# Altium project B106AA.PrjPcb (part 4 of 5)

## Sheet Battery Feed and Socket.SchDoc: System Battery Feed and Battery Socket
size A4; ApprovedBy: Mehmet Günce Akkoyun; CheckedBy: Mehmet Günce Akkoyun; Author: Mehmet Günce Akkoyun; CompanyName: Ovoo Electronics; DrawnBy: Mehmet Günce Akkoyun; Engineer: Mehmet Günce Akkoyun; Organization: Ovoo Electronics; Address1: Küçük Ýhsaniye Mah.; Address2: Mýzraklý Sok. No:15; Address3: Meram / Konya; Address4: Turkiye; DocumentNumber: AA005; Revision: B106AA; SheetNumber: 3; SheetTotal: 37
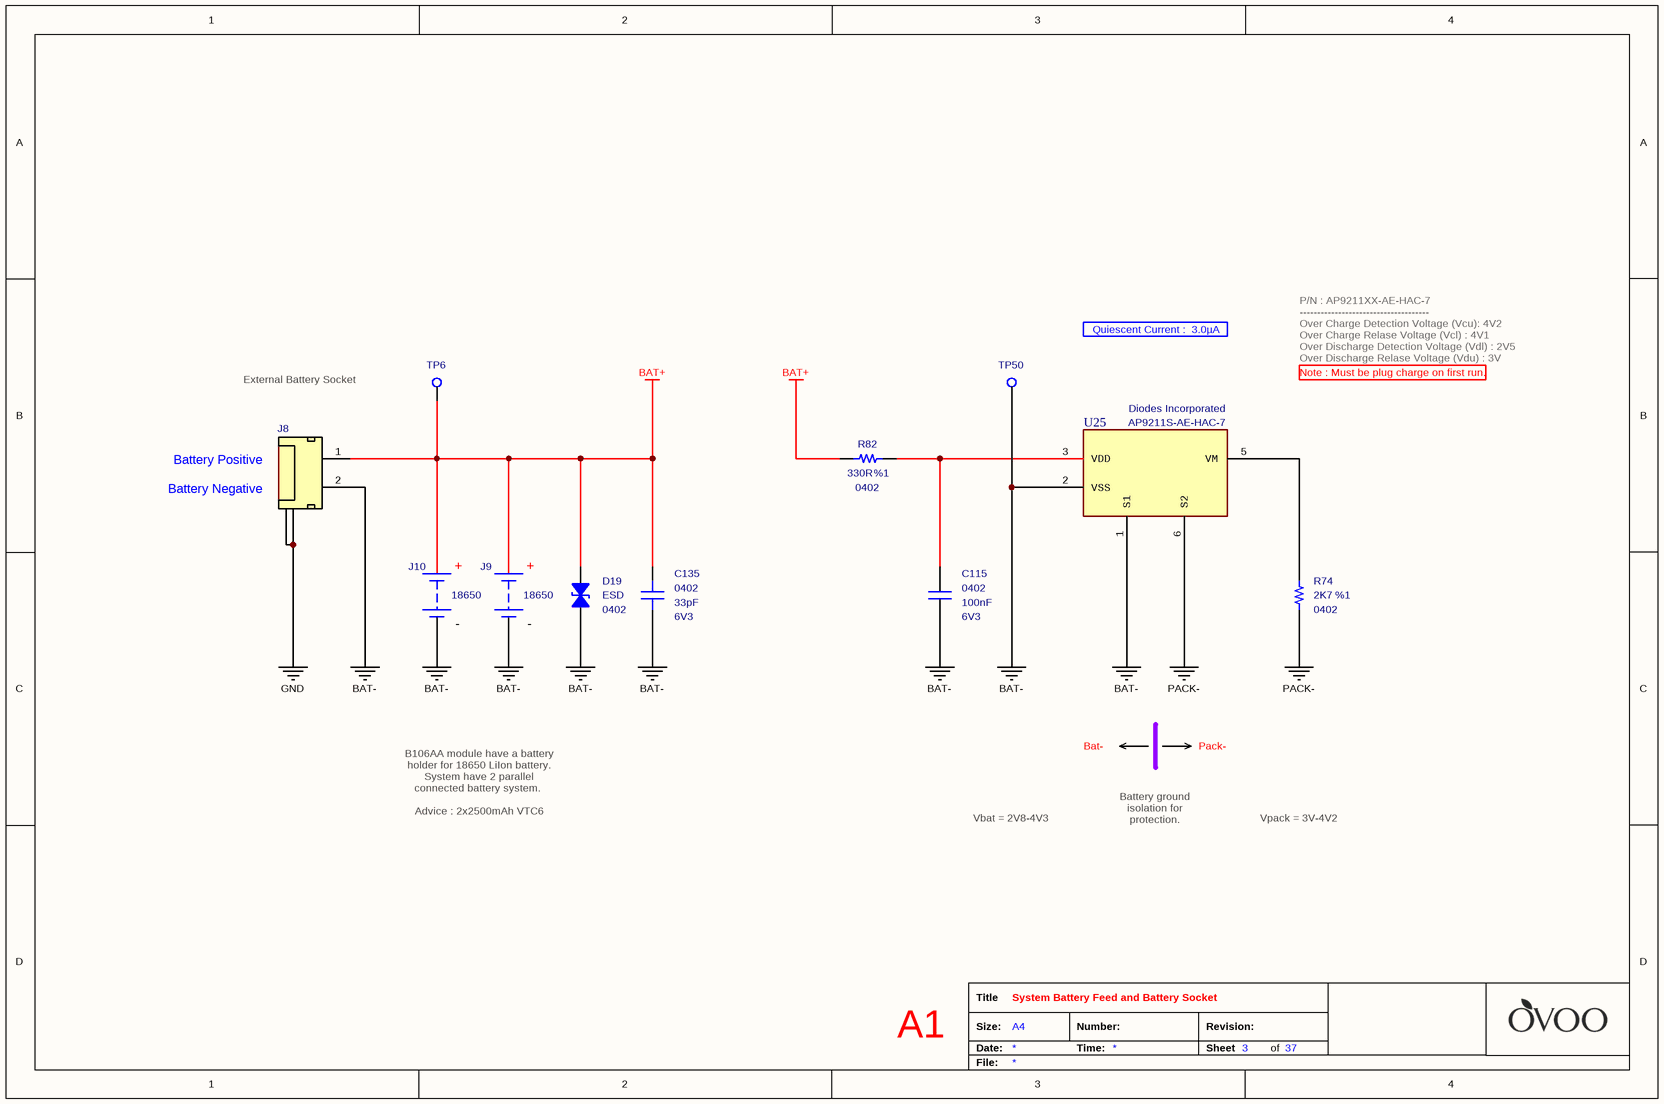
[diagram p29: Battery Feed and Socket.SchDoc]

### Parts
C115  value 100nF  Case: 0402  Voltage: 6V3  [CAPACITOR_0402]  (hidden comment: Multilayer Ceramic Capacitor)
C135  value 33pF  Case: 0402  Voltage: 6V3  [CAPACITOR_0402]  (hidden comment: Multilayer Ceramic Capacitor)
D19  Case: 0402  [ESD_0402]  (hidden comment: ESD Suppressors)
J8  External Battery Socket  [Connector_Tunic 2P - H]  (value not drawn)
J9  Battery Size: 18650  [BATTERY_HOLDER - Bat - NoSilk]  (hidden comment: Battery Clip Holder and Battery)
J10  Battery Size: 18650  [BATTERY_HOLDER - Bat - NoSilk]  (hidden comment: Battery Clip Holder and Battery)
R74  value 2K7  Case: 0402  Tolerance: %1  [RESISTOR_0402]  (hidden comment: Thick Film Resistor)
R82  value 330R  Tolerance: %1  Case: 0402  [RESISTOR_0402]  (hidden comment: Thick Film Resistor)
TP6  PCB - Test Point  [Test_Pad - Hole]  (value not drawn)  (no BOM)
TP50  PCB - Test Point  [Test_Pad - Hole]  (value not drawn)  (no BOM)
U25  Manufacturer_Part_Number: AP9211S-AE-HAC-7  Manufacturer_Name: Diodes Incorporated  [AP9211]  (hidden comment: Battery Management IC)

### Nets
BAT+: C135.2 D19.2 J8.1(BAT+) J9.1(BAT+) J10.1(BAT+) R82.2 TP6.1
BAT-: C115.2 C135.1 D19.1 J8.2(BAT-) J9.2(BAT-) J10.2(BAT-) TP50.1 U25.1(S1) U25.2(VSS)
GND: J8.3(Termination) J8.4(Termination)
PACK-: R74.1 U25.6(S2)
NetC115_1: C115.1 R82.1 U25.3(VDD)
NetR74_2: R74.2 U25.5(VM)

### Notes on the sheet
- Quiescent Current :  3.0µA
- External Battery Socket
- P/N : AP9211XX-AE-HAC-7
  -------------------------------------
  Over Charge Detection Voltage (Vcu): 4V2
  Over Charge Relase Voltage (Vcl) : 4V1
  Over Discharge Detection Voltage (Vdl) : 2V5
  Over Discharge Relase Voltage (Vdu) : 3V
- Note : Must be plug charge on first run.
- (near J8) Battery Positive
  Battery Negative
- Bat-
- Pack-
- B106AA module have a battery holder for 18650 LiIon battery. System have 2 parallel connected battery system.
  Advice : 2x2500mAh VTC6
- Vbat = 2V8-4V3
- Battery ground isolation for protection.
- Vpack = 3V-4V2
- A1
- Title
- Size:
- Date:
- A4
- Number:
- Time:
- Revision:
- Sheet
- of
- File:
- (in symbol Connector - Battery Clip Holder + Battery) +; -
- (in symbol Diode - ESD Protection) ESD

### Library data of the parts
C115 = Capacitor - 100nF [0402-6V3]: as C32 on sheet Bidirectional Voltage Translator; Height: 0.25mm; Mouser_Part_Number: 581-04026D104KAT4A; ComponentLink1Description: Mouser; ComponentLink1URL: https://www.mouser.com.tr/ProductDetail/AVX/04026D104KAT4A?qs=sGAEpiMZZMs0AnBnWHyRQPg4iYkCw7IMED%2F4kpqgf7w%3D; ComponentLink2Description: DataSheet; ComponentLink2URL: https://www.mouser.com.tr/datasheet/2/40/cx5r-776519.pdf; ROHS: Yes; Maximum Operating Temperature: +85; Minimum Operating Temperature: -55; Supplier 1: Avnet; Supplier Part Number 1: 04026D104KAT4A
C135 = Capacitor - 33pF [0402-6V3]: as C46 on sheet GE910QUAD Modem; Height: 0.5mm; Mouser_Part_Number: 80-C0402C330J9RAUTO; Maximum Operating Temperature: +125; Minimum Operating Temperature: -55; ROHS: Yes; ComponentLink1Description: DataSheet; ComponentLink1URL: https://api.kemet.com/component-edge/download/datasheet/C0402C330J9RACAUTO.pdf; ComponentLink2Description: Mouser; ComponentLink2URL: https://www.mouser.com/Search/Refine.aspx?Keyword=80-C0402C330J9RAUTO; Supplier 1: Mouser; Supplier Part Number 1: 80-C0402C330J9RAUTO
D19 = Diode - ESD Protection: TVS Diode (Bi-directional); Manufacturer_Part_Number: 0402ESDA-MLP1; Manufacturer_Name: Bussmann / Eaton; Clamping Voltage: 35V; Diode Capacitance: 0.05pF; Polarity: Bidirectional; Voltage ESD Air Gap: 15kV; Voltage ESD Contact: 8kV; Working Voltage: 30V; Height: 0.436mm; Mouser_Part_Number: 504-0402ESDA-MLP1; Maximum Operating Temperature: +125; Minimum Operating Temperature: -55; ROHS: Yes; ComponentLink1Description: DataSheet; ComponentLink1URL: https://www.mouser.com.tr/datasheet/2/87/47c59e11-d058-4882-bc35-d8572f2ca054-38826.pdf; ComponentLink2Description: Mouser; ComponentLink2URL: https://www.mouser.com.tr/ProductDetail/Bussmann-Eaton/0402ESDA-MLP1?qs=%2Fha2pyFadughxyc7TyLWeW%2FUvipVY6Ex3naV%2FjpO3plZBZWDLqV4bw%3D%3D; Supplier 1: Mouser; Supplier 2: Digi-Key; Supplier Part Number 2: 283-2964-1-ND; Supplier Part Number 1: 504-0402ESDA-MLP1
J8 = Connector - Mini Tunic 2P (1.25): Mini Tunic Connector with 2P; Manufacturer_Name: Molex; Manufacturer_Part_Number: 53261-0271; Height: 3.55mm; Mouser_Part_Number: 538-53261-0271; ROHS: Yes; Supplier 1: Mouser; Supplier 2: Digi-Key; Supplier Part Number 1: 538-53261-0271; Supplier Part Number 2: WM7620DKR-ND
J9 J10 = Connector - Battery Clip Holder + Battery: Cylindrical Battery Contacts, Clips, Holders & Springs 16MM - 19MM SM BATTERY CLIP; Manufacturer_Name: Keystone Electronics; Manufacturer_Part_Number: 254; ROHS: Yes; ComponentLink1Description: DataSheet; ComponentLink1URL: https://www.mouser.com.tr/datasheet/2/215/254-1662482.pdf; ComponentLink2Description: Mouser; ComponentLink2URL: https://www.mouser.com.tr/ProductDetail/Keystone-Electronics/254?qs=sGAEpiMZZMt13fpse6CWDeN7rxuhSMCmCb8dqu6gK9OS7H31eWULIQ==; Mouser_Part_Number: 534-254; Supplier 1: Mouser; Supplier Part Number 1: 534-550
R74 = Resistor - 2K7: Thick Film Resistors - SMD 1/16 W 2.7 Kohms 1%; Manufacturer_Name: Vishay; Manufacturer_Part_Number: CRCW04022K70FKED; Height: 0.35mm; Mouser_Part_Number: 71-CRCW0402-2.7K-E3; ComponentLink1Description: DataSheet; ComponentLink1URL: https://www.mouser.com.tr/datasheet/2/427/dcrcwe3-1762152.pdf; ComponentLink2Description: Mouser; ComponentLink2URL: https://www.mouser.com.tr/ProductDetail/Vishay-Dale/CRCW04022K70FKED?qs=sGAEpiMZZMu61qfTUdNhG7nHf%2F6MTUn3G4wz%252BGDNrew%3D; Supplier 1: Digi-Key; Supplier Part Number 1: 541-2.70KLCT-ND
R82 = Resistor - 330R: Thick Film Resistors - SMD 1/16 W 330 Ohm 1%; Manufacturer_Name: Vishay; Manufacturer_Part_Number: CRCW0402330RFKED; Height: 0.4mm; Mouser_Part_Number: 71-CRCW0402-330-E3; ComponentLink1Description: DataSheet; ComponentLink1URL: https://www.mouser.com.tr/datasheet/2/427/dcrcwe3-1762152.pdf; ComponentLink2Description: Mouser; ComponentLink2URL: https://www.mouser.com.tr/ProductDetail/Vishay-Dale/CRCW0402330RFKED?qs=sGAEpiMZZMu61qfTUdNhG2DpbjADlD3GGS6SwBlLi5Q%3D; Supplier 1: Mouser; Supplier 2: Digi-Key; Supplier Part Number 2: 541-330LCT-ND; Supplier Part Number 1: 71-CRCW0402-330-E3
TP6 TP50 = PCB - Test Point: Test Point
U25 = IC - AP9211: Battery Management SGL Chip Protection 12Vdss 12Vgss 1000mW; AECQ10x: No; Built-In Dual NMOS: Yes; Charge Overcurrent Detection Voltage VCOC: 0.2 to 0.05 V; Detection Delay: Built-In Delay Timer; Discharge Overcurrent Detection Voltage VDOC: 0.05 to 0.32 V; Function: Battery Protection; Load Short Detection Voltage VSHORT: 0.16 to 0.32 V; Overcharge Detection Voltage VCU: 3.5 to 4.5 V; Overdischarge Detection Voltage VDL: 2 to 3.4 V; Power-Down Function: Selectable; RSS(ON) @VGS=3.9V: 27 mΩ; RoHS: Yes; Mouser_Part_Number: 621-AP9211S-AE-HAC-7; Case: U-DFN2030-6; ComponentLink1Description: DataSheet; ComponentLink1URL: https://www.mouser.com.tr/datasheet/2/115/AP9211-838143.pdf; ComponentLink2Description: Mouser; ComponentLink2URL: https://www.mouser.com.tr/ProductDetail/Diodes-Incorporated/AP9211S-AE-HAC-7?qs=%2Fha2pyFaduhU8ORG8s%252BdQ0PvBZ%252Bj6P04h11i28rtWnQ%2FLO517Oqhtw%3D%3D; ComponentLink3Description: ProductPage; ComponentLink3URL: https://www.diodes.com/part/view/AP9211; Application: 1-Cell; Automotive Compliant PPAP: No; Supplier 1: Mouser; Supplier Part Number 1: 621-AP9211S-AE-HAC-7

## Sheet Battery Measurement.SchDoc: Battery Measurement With I2C Isolation
size A4; ApprovedBy: Mehmet Günce Akkoyun; CheckedBy: Mehmet Günce Akkoyun; Author: Mehmet Günce Akkoyun; CompanyName: Ovoo Electronics; DrawnBy: Mehmet Günce Akkoyun; Engineer: Mehmet Günce Akkoyun; Organization: Ovoo Electronics; Address1: Küçük Ýhsaniye Mah.; Address2: Mýzraklý Sok. No:15; Address3: Meram / Konya; Address4: Turkiye; DocumentNumber: AA005; Revision: B106AA; SheetNumber: 4; SheetTotal: 37
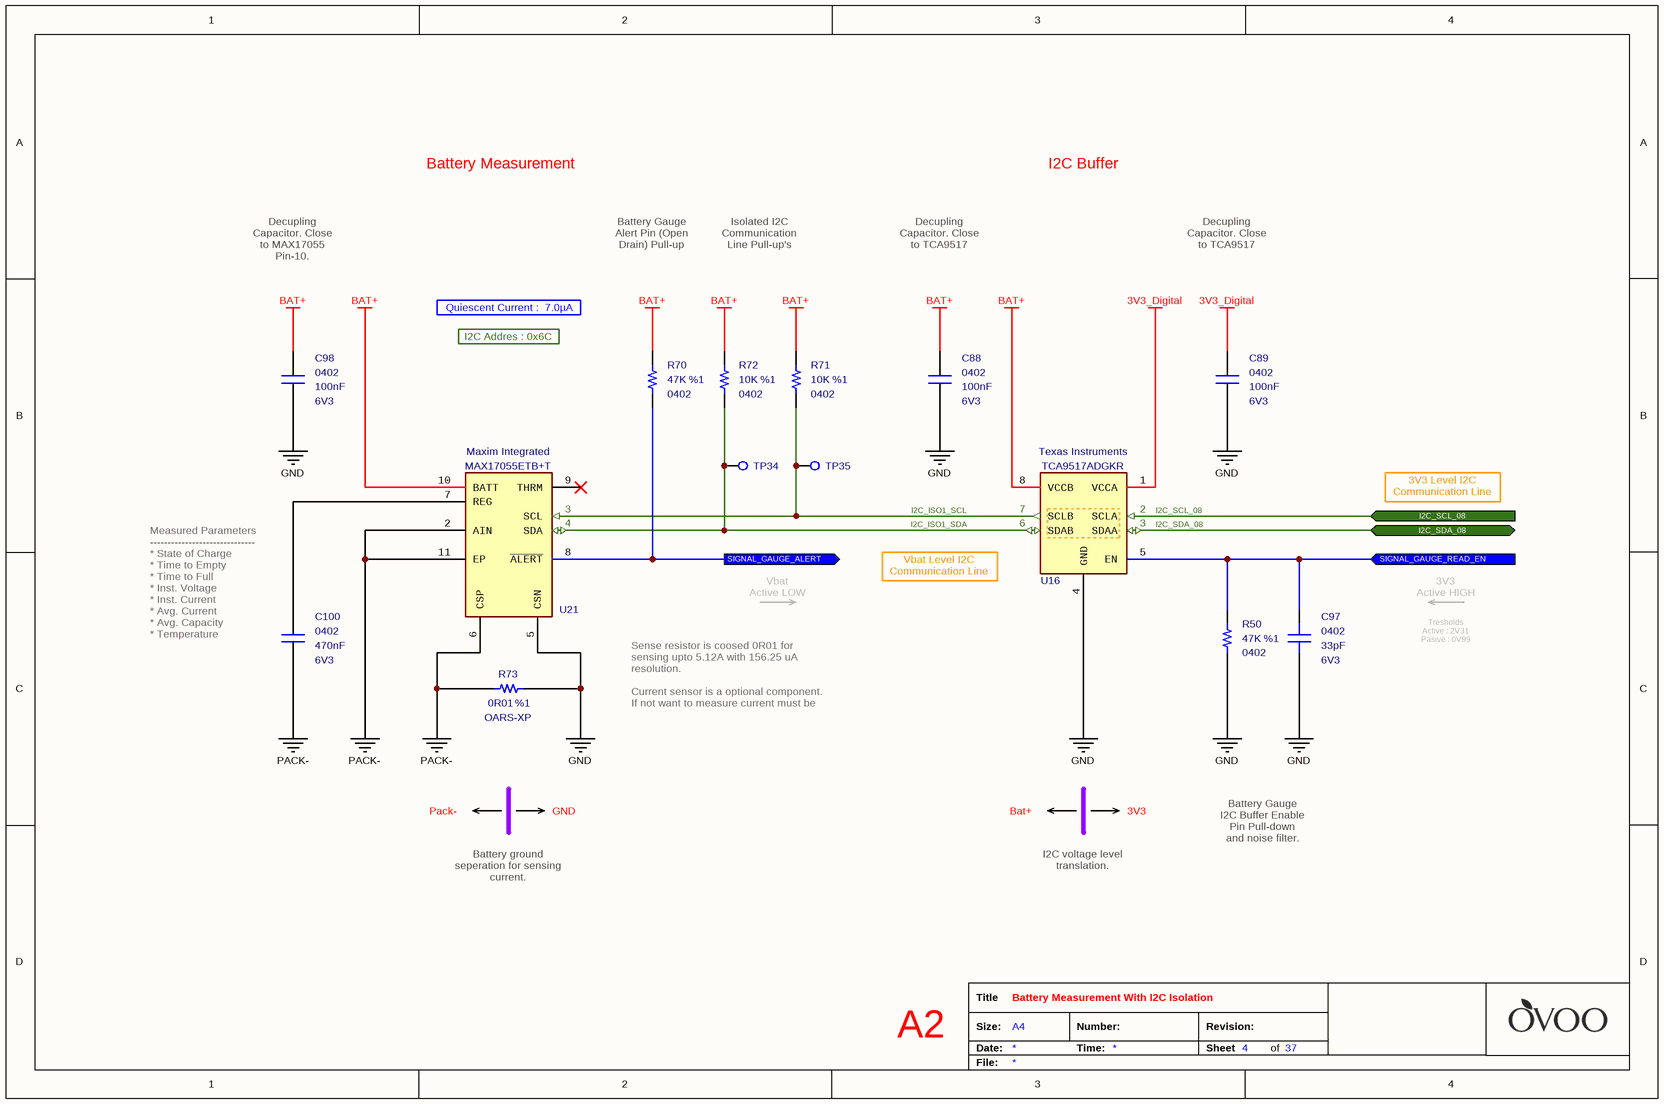
[diagram p30: Battery Measurement.SchDoc]

### Parts
C88  value 100nF  Case: 0402  Voltage: 6V3  [CAPACITOR_0402]  (hidden comment: Multilayer Ceramic Capacitor)
C89  value 100nF  Case: 0402  Voltage: 6V3  [CAPACITOR_0402]  (hidden comment: Multilayer Ceramic Capacitor)
C97  value 33pF  Case: 0402  Voltage: 6V3  [CAPACITOR_0402]  (hidden comment: Multilayer Ceramic Capacitor)
C98  value 100nF  Case: 0402  Voltage: 6V3  [CAPACITOR_0402]  (hidden comment: Multilayer Ceramic Capacitor)
C100  value 470nF  Case: 0402  Voltage: 6V3  [CAPACITOR_0402]  (hidden comment: Multilayer Ceramic Capacitors)
R50  value 47K  Tolerance: %1  Case: 0402  [RESISTOR_0402]  (hidden comment: Thick Film Resistor)
R70  value 47K  Tolerance: %1  Case: 0402  [RESISTOR_0402]  (hidden comment: Thick Film Resistor)
R71  value 10K  Tolerance: %1  Case: 0402  [RESISTOR_0402]  (hidden comment: Thick Film Resistor)
R72  value 10K  Tolerance: %1  Case: 0402  [RESISTOR_0402]  (hidden comment: Thick Film Resistor)
R73  value 0R01  Case: OARS-XP  Tolerance: %1  [RESISTOR_OARSXP]  (hidden comment: Current Sense Resistor)
TP34  PCB - Test Point  [Test_Pad - Hole]  (value not drawn)  (no BOM)
TP35  PCB - Test Point  [Test_Pad - Hole]  (value not drawn)  (no BOM)
U16  Manufacturer_Name: Texas Instruments  Manufacturer_Part_Number: TCA9517ADGKR  [MSOP-8-4]  (hidden comment: I2C Bus Repeater)
U21  Manufacturer_Part_Number: MAX17055ETB+T  Manufacturer_Name: Maxim Integrated  [TDFN-10]  (hidden comment: Battery Gauge)

### Ports
I2C_SCL_08 (in), I2C_SDA_08 (bidir), SIGNAL_GAUGE_ALERT (out), SIGNAL_GAUGE_READ_EN (in)

### Nets
3V3_Digital: C89.1 U16.1(VCCA)
BAT+: C88.1 C98.1 R70.2 R71.2 R72.2 U16.8(VCCB) U21.10(BATT)
GND: C88.2 C89.2 C97.1 C98.2 R50.1 R73.1 U16.4(GND) U21.5(CSN)
PACK-: C100.1 R73.2 U21.2(AIN) U21.6(CSP) U21.11(EP)
I2C_ISO1_SCL: R71.1 TP35.1(TP) U16.7(SCLB) U21.3(SCL)
I2C_ISO1_SDA: R72.1 TP34.1 U16.6(SDAB) U21.4(SDA)
I2C_SCL_08: U16.2(SCLA) ; port I2C_SCL_08
I2C_SDA_08: U16.3(SDAA) ; port I2C_SDA_08
SIGNAL_GAUGE_ALERT: R70.1 U21.8(~{ALERT}) ; port SIGNAL_GAUGE_ALERT
NetC97_2: C97.2 R50.2 U16.5(EN) ; port SIGNAL_GAUGE_READ_EN
NetC100_2: C100.2 U21.7(REG)

Not connected (* = marked no-connect by the designer): U21 9(THRM)*

### Notes on the sheet
- Battery Measurement
- I2C Buffer
- Decupling Capacitor. Close to MAX17055 Pin-10.
- Battery Gauge Alert Pin (Open Drain) Pull-up
- Isolated I2C Communication Line Pull-up's
- Decupling Capacitor. Close to TCA9517 Pin-8.
- Decupling Capacitor. Close to TCA9517 Pin-1.
- Quiescent Current :  7.0µA
- I2C Addres : 0x6C
- 3V3 Level I2C
  Communication Line
- Vbat
  Active LOW
- (near U16) Vbat Level I2C
  Communication Line
- 3V3
  Active HIGH
- (near C100) Measured Parameters
  ------------------------------
  * State of Charge
  * Time to Empty
  * Time to Full
  * Inst. Voltage
  * Inst. Current
  * Avg. Current
  * Avg. Capacity
  * Temperature
- Tresholds
  Active : 2V31
  Pasive : 0V99
- Sense resistor is coosed 0R01 for sensing upto 5.12A with 156.25 uA resolution.
  Current sensor is a optional component. If not want to measure current must be connect PACK- to GND.
- Pack-
- GND
- Bat+
- 3V3
- Battery Gauge I2C Buffer Enable Pin Pull-down and noise filter.
- Battery ground seperation for sensing current.
- I2C voltage level translation.
- A2
- Title
- Size:
- Date:
- A4
- Number:
- Time:
- Revision:
- Sheet
- of
- File:

### Library data of the parts
C88 C89 C98 = Capacitor - 100nF [0402-6V3]: Capacitor - 100nF [0402-6V3] (Ceramic); Manufacturer_Name: AVX; Manufacturer_Part_Number: 04026D104KAT4A; Dielectric: X5R; Tolerance: %10; Height: 0.25mm; Mouser_Part_Number: 581-04026D104KAT4A; ComponentLink1Description: Mouser; ComponentLink1URL: https://www.mouser.com.tr/ProductDetail/AVX/04026D104KAT4A?qs=sGAEpiMZZMs0AnBnWHyRQPg4iYkCw7IMED%2F4kpqgf7w%3D; ComponentLink2Description: DataSheet; ComponentLink2URL: https://www.mouser.com.tr/datasheet/2/40/cx5r-776519.pdf; ROHS: Yes; Maximum Operating Temperature: +85; Minimum Operating Temperature: -55; Supplier 1: Avnet; Supplier Part Number 1: 04026D104KAT4A
C97 = Capacitor - 33pF [0402-6V3]: Capacitor - 33pF [0402] (Ceramic); Manufacturer_Name: Kemet; Manufacturer_Part_Number: C0402C330J9RACAUTO; Dielectric: X7R; Tolerance: 10%; Height: 0.5mm; Mouser_Part_Number: 80-C0402C330J9RAUTO; Maximum Operating Temperature: +125; Minimum Operating Temperature: -55; ROHS: Yes; ComponentLink1Description: DataSheet; ComponentLink1URL: https://api.kemet.com/component-edge/download/datasheet/C0402C330J9RACAUTO.pdf; ComponentLink2Description: Mouser; ComponentLink2URL: https://www.mouser.com/Search/Refine.aspx?Keyword=80-C0402C330J9RAUTO; Supplier 1: Mouser; Supplier Part Number 1: 80-C0402C330J9RAUTO
C100 = Capacitor - 470nF [0402-6V3]: Capacitor - 470nF [0402] (Ceramic); Manufacturer_Name: AVX; Manufacturer_Part_Number: 04026C474KAT2A; Dielectric: X7R; Tolerance: %10; Height: 0.4mm; Mouser_Part_Number: 581-04026C474KAT2A; ComponentLink1Description: Mouser; ComponentLink1URL: https://www.mouser.com.tr/ProductDetail/AVX/04026D104KAT4A?qs=sGAEpiMZZMs0AnBnWHyRQPg4iYkCw7IMED%2F4kpqgf7w%3D; ComponentLink2Description: DataSheet; ComponentLink2URL: https://www.mouser.com.tr/datasheet/2/40/cx5r-776519.pdf; ROHS: Yes; Maximum Operating Temperature: +125; Minimum Operating Temperature: -55; Supplier 1: Mouser; Supplier Part Number 1: 581-04026C474KAT2A
R50 R70 = Resistor - 47K: Thick Film Resistors - SMD 1/16 W 47 Kohms 1%; Manufacturer_Name: Vishay; Manufacturer_Part_Number: CRCW040247K0FKED; Height: 0.4mm; Mouser_Part_Number: 71-CRCW0402-47K-E3; ComponentLink1Description: DataSheet; ComponentLink1URL: https://www.mouser.com.tr/datasheet/2/427/dcrcwe3-1762152.pdf; ComponentLink2Description: Mouser; ComponentLink2URL: https://www.mouser.com.tr/ProductDetail/Vishay-Dale/CRCW040247K0FKED?qs=sGAEpiMZZMu61qfTUdNhG2DpbjADlD3GL%252B3h1elTxqU%3D; Supplier 1: Mouser; Supplier 2: Digi-Key; Supplier Part Number 1: 71-CRCW040247K0FKEDH; Supplier Part Number 2: 541-47.0KYCT-ND
R71 R72 = Resistor - 10K: Thick Film Resistors - SMD 1/16 W 10 Kohms 1%; Manufacturer_Name: Vishay; Manufacturer_Part_Number: CRCW040210K0FKED; Height: 0.4mm; Mouser_Part_Number: 71-CRCW0402-10K-E3; ComponentLink1Description: DataSheet; ComponentLink1URL: https://www.mouser.com.tr/datasheet/2/427/dcrcwe3-1762152.pdf; ComponentLink2Description: Mouser; ComponentLink2URL: https://www.mouser.com.tr/ProductDetail/Vishay-Dale/CRCW040210K0FKED?qs=sGAEpiMZZMu61qfTUdNhG2DpbjADlD3GcalbOv9utCY%3D; Supplier 1: Mouser; Supplier 2: Digi-Key; Supplier Part Number 1: 71-CRCW040210K0FKEDH; Supplier Part Number 2: 541-10.0KYCT-ND
R73 = Resistor - 0R01 (Current Sense): Current Sense Resistors - SMD 10 W 0.01 ohms 1%; Manufacturer_Name: TT Electronics; Manufacturer_Part_Number: OARSXPR010FLF; Height: 4.57mm; Mouser_Part_Number: 66-OARSXPR010FLF; ComponentLink1Description: DataSheet; ComponentLink1URL: https://www.mouser.com.tr/datasheet/2/414/OARS-1528401.pdf; ComponentLink2Description: Mouser; ComponentLink2URL: https://www.mouser.com.tr/ProductDetail/Welwyn-Components-TT-Electronics/OARSXPR010FLF?qs=sGAEpiMZZMtlleCFQhR%2FzeTNl4NhfdapppP6XDTtD%252Bk%3D; Supplier 1: Mouser; Supplier 2: Arrow; Supplier Part Number 1: 66-OARSXPR010FLF; Supplier Part Number 2: OARSXPR010FLF
TP34 TP35 = PCB - Test Point: Test Point
U16 = IC - TCA9517ADGKR: Interface - Signal Buffers, Repeaters Level-Translting I2C Bus Repeater; Propagation Delay Time: 141 nS; Operating Supply Voltage: 900 mV to 5.5 V; Operating Supply Current: 1mA; Ciss - Input Capacitance: 8pF; Height: 1.1mm; Mouser Part Number: 595-TCA9517ADGKR; ComponentLink1Description: DataSheet; ComponentLink1URL: http://www.ti.com/general/docs/suppproductinfo.tsp?distId=26&gotoUrl=http%3A%2F%2Fwww.ti.com%2Flit%2Fgpn%2Ftca9517a; ComponentLink2Description: Mouser; ComponentLink2URL: https://www.mouser.com.tr/ProductDetail/Texas-Instruments/TCA9517ADGKR?qs=%252BrH4t%252BeVZ2M4pVnwXR4oNA==; Minimum Operating Temperature: -40; Maximum Operating Temperature: +85; Case: VSSOP-8; Supplier 1: Mouser; Supplier 2: Digi-Key; Supplier Part Number 1: 595-TCA9517ADGKR; Supplier Part Number 2: 296-39220-1-ND
U21 = IC - MAX17055ETB+T: Battery Management Stand-Alone ModelGauge m5 Fuel Gauge; Battery Type: Li-Ion, LiFePO4; Operating Supply Current: 18 uA; Operating Supply Voltage: 2.3 V to 4.9 V; Height: 0.8mm; Mouser_Part_Number: 700-MAX17055ETB+T; ComponentLink1Description: DataSheet; ComponentLink1URL: https://www.mouser.com.tr/datasheet/2/256/MAX17055-1097125.pdf; ComponentLink2Description: Mouser; ComponentLink2URL: https://www.mouser.com.tr/ProductDetail/Maxim-Integrated/MAX17055ETB%2bT?qs=sGAEpiMZZMve4%2FbfQkoj%252BAs6FTSsQJaJrD7Z3v0Qe9M%3D; Minimum Operating Temperature: -40; Maximum Operating Temperature: +85; Case: TDFN-10; Supplier 1: Mouser; Supplier 2: Digi-Key; Supplier Part Number 2: MAX17055ETB+TCT-ND; Supplier Part Number 1: 700-MAX17055ETB+T

## Sheet Battery Charger.SchDoc: Battery Charger
size A4; ApprovedBy: Mehmet Günce Akkoyun; CheckedBy: Mehmet Günce Akkoyun; Author: Mehmet Günce Akkoyun; CompanyName: Ovoo Electronics; DrawnBy: Mehmet Günce Akkoyun; Engineer: Mehmet Günce Akkoyun; Organization: Ovoo Electronics; Address1: Küçük Ýhsaniye Mah.; Address2: Mýzraklý Sok. No:15; Address3: Meram / Konya; Address4: Turkiye; DocumentNumber: AA005; Revision: B106AA; SheetNumber: 5; SheetTotal: 37
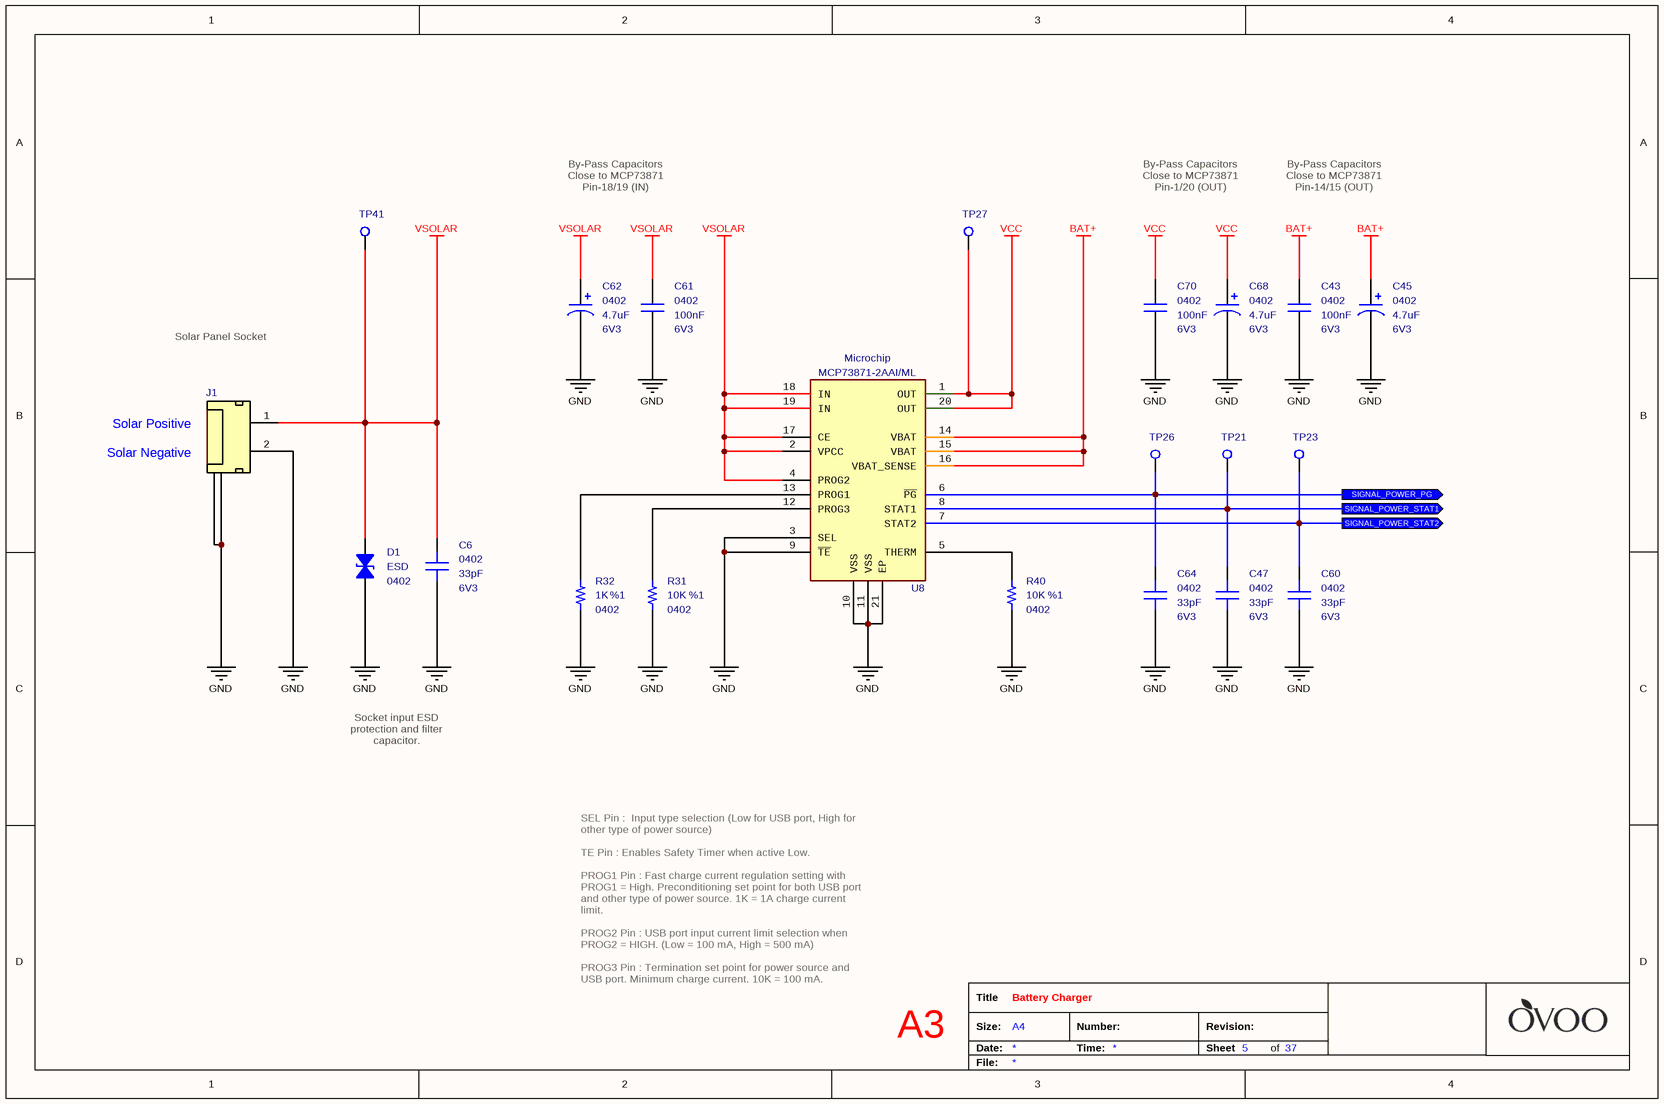
[diagram p31: Battery Charger.SchDoc]

### Parts
C6  value 33pF  Case: 0402  Voltage: 6V3  [CAPACITOR_0402]  (hidden comment: Multilayer Ceramic Capacitor)
C43  value 100nF  Case: 0402  Voltage: 6V3  [CAPACITOR_0402]  (hidden comment: Multilayer Ceramic Capacitor)
C45  value 4.7uF  Case: 0402  Voltage: 6V3  [CAPACITOR_0402]  (hidden comment: Multilayer Ceramic Capacitors)
C47  value 33pF  Case: 0402  Voltage: 6V3  [CAPACITOR_0402]  (hidden comment: Multilayer Ceramic Capacitor)
C60  value 33pF  Case: 0402  Voltage: 6V3  [CAPACITOR_0402]  (hidden comment: Multilayer Ceramic Capacitor)
C61  value 100nF  Case: 0402  Voltage: 6V3  [CAPACITOR_0402]  (hidden comment: Multilayer Ceramic Capacitor)
C62  value 4.7uF  Case: 0402  Voltage: 6V3  [CAPACITOR_0402]  (hidden comment: Multilayer Ceramic Capacitors)
C64  value 33pF  Case: 0402  Voltage: 6V3  [CAPACITOR_0402]  (hidden comment: Multilayer Ceramic Capacitor)
C68  value 4.7uF  Case: 0402  Voltage: 6V3  [CAPACITOR_0402]  (hidden comment: Multilayer Ceramic Capacitors)
C70  value 100nF  Case: 0402  Voltage: 6V3  [CAPACITOR_0402]  (hidden comment: Multilayer Ceramic Capacitor)
D1  Case: 0402  [ESD_0402]  (hidden comment: ESD Suppressors)
J1  Solar Power Socket  [Connector_Tunic 2P - H]  (value not drawn)
R31  value 10K  Tolerance: %1  Case: 0402  [RESISTOR_0402]  (hidden comment: Thick Film Resistor)
R32  value 1K  Case: 0402  Tolerance: %1  [RESISTOR_0402]  (hidden comment: Thick Film Resistor)
R40  value 10K  Tolerance: %1  Case: 0402  [RESISTOR_0402]  (hidden comment: Thick Film Resistor)
TP21  PCB - Test Point  [Test_Pad - Hole]  (value not drawn)  (no BOM)
TP23  PCB - Test Point  [Test_Pad - Hole]  (value not drawn)  (no BOM)
TP26  PCB - Test Point  [Test_Pad - Hole]  (value not drawn)  (no BOM)
TP27  PCB - Test Point  [Test_Pad - Hole]  (value not drawn)  (no BOM)
TP41  PCB - Test Point  [Test_Pad - Hole]  (value not drawn)  (no BOM)
U8  Manufacturer_Name: Microchip  Manufacturer_Part_Number: MCP73871-2AAI/ML  [QFN20]  (hidden comment: Battery Charger)

### Ports
SIGNAL_POWER_PG (out), SIGNAL_POWER_STAT1 (out), SIGNAL_POWER_STAT2 (out)

### Nets
BAT+: C43.1 C45.1 U8.14(VBAT) U8.15(VBAT) U8.16(VBAT_SENSE)
GND: C6.1 C43.2 C45.2 C47.2 C60.2 C61.2 C62.2 C64.2 C68.2 C70.2 D1.1 J1.2(GND) J1.3(Termination) J1.4(Termination) R31.1 R32.1 R40.1 U8.3(SEL) U8.9(~{TE}) U8.10(VSS) U8.11(VSS) U8.21(EP)
VCC: C68.1 C70.1 TP27.1 U8.1(OUT) U8.20(OUT)
VSOLAR: C6.2 C61.1 C62.1 D1.2 J1.1(VSolar) TP41.1 U8.2(VPCC) U8.4(PROG2) U8.17(CE) U8.18(IN) U8.19(IN)
NetC47_1: C47.1 TP21.1 U8.8(STAT1) ; port SIGNAL_POWER_STAT1
NetC60_1: C60.1 TP23.1 U8.7(STAT2) ; port SIGNAL_POWER_STAT2
NetC64_1: C64.1 TP26.1 U8.6(~{PG}) ; port SIGNAL_POWER_PG
NetR31_2: R31.2 U8.12(PROG3)
NetR32_2: R32.2 U8.13(PROG1)
NetR40_2: R40.2 U8.5(THERM)

### Notes on the sheet
- By-Pass Capacitors
  Close to MCP73871
  Pin-18/19 (IN)
- By-Pass Capacitors
  Close to MCP73871
  Pin-1/20 (OUT)
- By-Pass Capacitors
  Close to MCP73871
  Pin-14/15 (OUT)
- Solar Panel Socket
- (near J1) Solar Positive
  Solar Negative
- Socket input ESD protection and filter capacitor.
- SEL Pin :  Input type selection (Low for USB port, High for other type of power source)
  TE Pin : Enables Safety Timer when active Low.
  PROG1 Pin : Fast charge current regulation setting with PROG1 = High. Preconditioning set point for both USB port and other type of power source. 1K = 1A charge current limit.
  PROG2 Pin : USB port input current limit selection when PROG2 = HIGH. (Low = 100 mA, High = 500 mA)
  PROG3 Pin : Termination set point for power source and USB port. Minimum charge current. 10K = 100 mA.
- A3
- Title
- Size:
- Date:
- A4
- Number:
- Time:
- Revision:
- Sheet
- of
- File:
- (in symbol Diode - ESD Protection) ESD

### Library data of the parts
C6 C47 C60 C64 = Capacitor - 33pF [0402-6V3]: as C97 on sheet Battery Measurement; Height: 0.5mm; Mouser_Part_Number: 80-C0402C330J9RAUTO; Maximum Operating Temperature: +125; Minimum Operating Temperature: -55; ROHS: Yes; ComponentLink1Description: DataSheet; ComponentLink1URL: https://api.kemet.com/component-edge/download/datasheet/C0402C330J9RACAUTO.pdf; ComponentLink2Description: Mouser; ComponentLink2URL: https://www.mouser.com/Search/Refine.aspx?Keyword=80-C0402C330J9RAUTO; Supplier 1: Mouser; Supplier Part Number 1: 80-C0402C330J9RAUTO
C43 C61 C70 = Capacitor - 100nF [0402-6V3]: as C88 on sheet Battery Measurement; Height: 0.25mm; Mouser_Part_Number: 581-04026D104KAT4A; ComponentLink1Description: Mouser; ComponentLink1URL: https://www.mouser.com.tr/ProductDetail/AVX/04026D104KAT4A?qs=sGAEpiMZZMs0AnBnWHyRQPg4iYkCw7IMED%2F4kpqgf7w%3D; ComponentLink2Description: DataSheet; ComponentLink2URL: https://www.mouser.com.tr/datasheet/2/40/cx5r-776519.pdf; ROHS: Yes; Maximum Operating Temperature: +85; Minimum Operating Temperature: -55; Supplier 1: Avnet; Supplier Part Number 1: 04026D104KAT4A
C45 C62 C68 = Capacitor - 4.7uF [0402-6V3): Capacitor - 4.7uF [0402] (Ceramic); Manufacturer_Name: Kemet; Manufacturer_Part_Number: C0402C475M9PACTU; Dielectric: X5R; Tolerance: %20; Height: 0.5mm; Mouser_Part_Number: 80-C0402C475M9P; ComponentLink1Description: Mouser; ComponentLink1URL: https://www.mouser.com.tr/ProductDetail/KEMET/C0402C475M9PACTU?qs=x4XeXhDQKnr0GX0Xu9DUoQ==; ComponentLink2Description: DataSheet; ComponentLink2URL: https://www.mouser.com.tr/datasheet/2/40/cx5r-776519.pdf; ROHS: Yes; Maximum Operating Temperature: +85; Minimum Operating Temperature: -55; Supplier 1: Mouser; Supplier 2: Arrow; Supplier 3: Farnell; Supplier 4: Digi-Key; Supplier Part Number 1: 80-C0402C475M9P; Supplier Part Number 2: C0402C475M9PACTU; Supplier Part Number 3: 2750760; Supplier Part Number 4: 399-13068-1-ND
D1 = Diode - ESD Protection: TVS Diode (Bi-directional); Manufacturer_Name: Bussmann / Eaton; Manufacturer_Part_Number: 0402ESDA-MLP1; Clamping Voltage: 35V; Diode Capacitance: 0.05pF; Polarity: Bidirectional; Voltage ESD Air Gap: 15kV; Voltage ESD Contact: 8kV; Working Voltage: 30V; Height: 0.436mm; Mouser_Part_Number: 504-0402ESDA-MLP1; Maximum Operating Temperature: +125; Minimum Operating Temperature: -55; ROHS: Yes; ComponentLink1Description: DataSheet; ComponentLink1URL: https://www.mouser.com.tr/datasheet/2/87/47c59e11-d058-4882-bc35-d8572f2ca054-38826.pdf; ComponentLink2Description: Mouser; ComponentLink2URL: https://www.mouser.com.tr/ProductDetail/Bussmann-Eaton/0402ESDA-MLP1?qs=%2Fha2pyFadughxyc7TyLWeW%2FUvipVY6Ex3naV%2FjpO3plZBZWDLqV4bw%3D%3D; Supplier 1: Mouser; Supplier 2: Digi-Key; Supplier Part Number 2: 283-2964-1-ND; Supplier Part Number 1: 504-0402ESDA-MLP1
J1 = Connector - Mini Tunic 2P (1.25): Mini Tunic Connector with 2P; Manufacturer_Name: Molex; Manufacturer_Part_Number: 53261-0271; Height: 3.55mm; Mouser_Part_Number: 538-53261-0271; ROHS: Yes; Supplier 1: Mouser; Supplier 2: Digi-Key; Supplier Part Number 1: 538-53261-0271; Supplier Part Number 2: WM7620DKR-ND
R31 R40 = Resistor - 10K: as R71 on sheet Battery Measurement; Height: 0.4mm; Mouser_Part_Number: 71-CRCW0402-10K-E3; ComponentLink1Description: DataSheet; ComponentLink1URL: https://www.mouser.com.tr/datasheet/2/427/dcrcwe3-1762152.pdf; ComponentLink2Description: Mouser; ComponentLink2URL: https://www.mouser.com.tr/ProductDetail/Vishay-Dale/CRCW040210K0FKED?qs=sGAEpiMZZMu61qfTUdNhG2DpbjADlD3GcalbOv9utCY%3D; Supplier 1: Mouser; Supplier 2: Digi-Key; Supplier Part Number 1: 71-CRCW040210K0FKEDH; Supplier Part Number 2: 541-10.0KYCT-ND
R32 = Resistor - 1K: Thick Film Resistors - SMD 1/16 W 1.0 Kohms 1%; Manufacturer_Name: Vishay; Manufacturer_Part_Number: CRCW04021K00FKED; Height: 0.35mm; Mouser_Part_Number: 71-CRCW0402-1.0K-E3; ComponentLink1Description: DataSheet; ComponentLink1URL: https://www.mouser.com.tr/datasheet/2/427/dcrcwe3-1762152.pdf; ComponentLink2Description: Mouser; ComponentLink2URL: https://www.mouser.com.tr/ProductDetail/Vishay-Dale/CRCW04021K00FKED?qs=sGAEpiMZZMu61qfTUdNhG2DpbjADlD3GFJ4zSbeLqG8%3D; Supplier 1: Mouser; Supplier 2: Digi-Key; Supplier Part Number 1: 71-CRCW0402-1.0K-E3; Supplier Part Number 2: 541-1.00KLCT-ND
TP21 TP23 TP26 TP27 TP41 = PCB - Test Point: Test Point
U8 = IC - MCP73871: Battery Management USB/AC Battery Charger; Height: 1mm; Mouser_Part_Number: 579-MCP73871-2AAI/ML; ComponentLink1Description: DataSheet; ComponentLink1URL: https://www.mouser.com.tr/datasheet/2/268/22090a-52174.pdf; ComponentLink2Description: Mouser; ComponentLink2URL: https://www.mouser.com.tr/ProductDetail/Microchip-Technology/MCP73871-2AAI-ML?qs=sGAEpiMZZMurkbBc78uWVAic%2FwpkFaWG; Supplier 1: Mouser; Supplier 2: Future Electronics; Supplier 3: Farnell; Supplier 4: Digi-Key; Supplier 5: Newark; Supplier Part Number 1: 579-MCP73871-2AAI/ML; Supplier Part Number 2: MCP73871-2AAI/ML-TUBE; Supplier Part Number 3: 1642487; Supplier Part Number 4: MCP73871-2AAI/ML-ND; Supplier Part Number 5: 09P4000; Case: QFN-20

## Sheet Buck Boost Converter.SchDoc: Buck Boost Converter
size A4; ApprovedBy: Mehmet Günce Akkoyun; CheckedBy: Mehmet Günce Akkoyun; Author: Mehmet Günce Akkoyun; CompanyName: Ovoo Electronics; DrawnBy: Mehmet Günce Akkoyun; Engineer: Mehmet Günce Akkoyun; Organization: Ovoo Electronics; Address1: Küçük Ýhsaniye Mah.; Address2: Mýzraklý Sok. No:15; Address3: Meram / Konya; Address4: Turkiye; DocumentNumber: AA005; Revision: B106AA; SheetNumber: 6; SheetTotal: 37
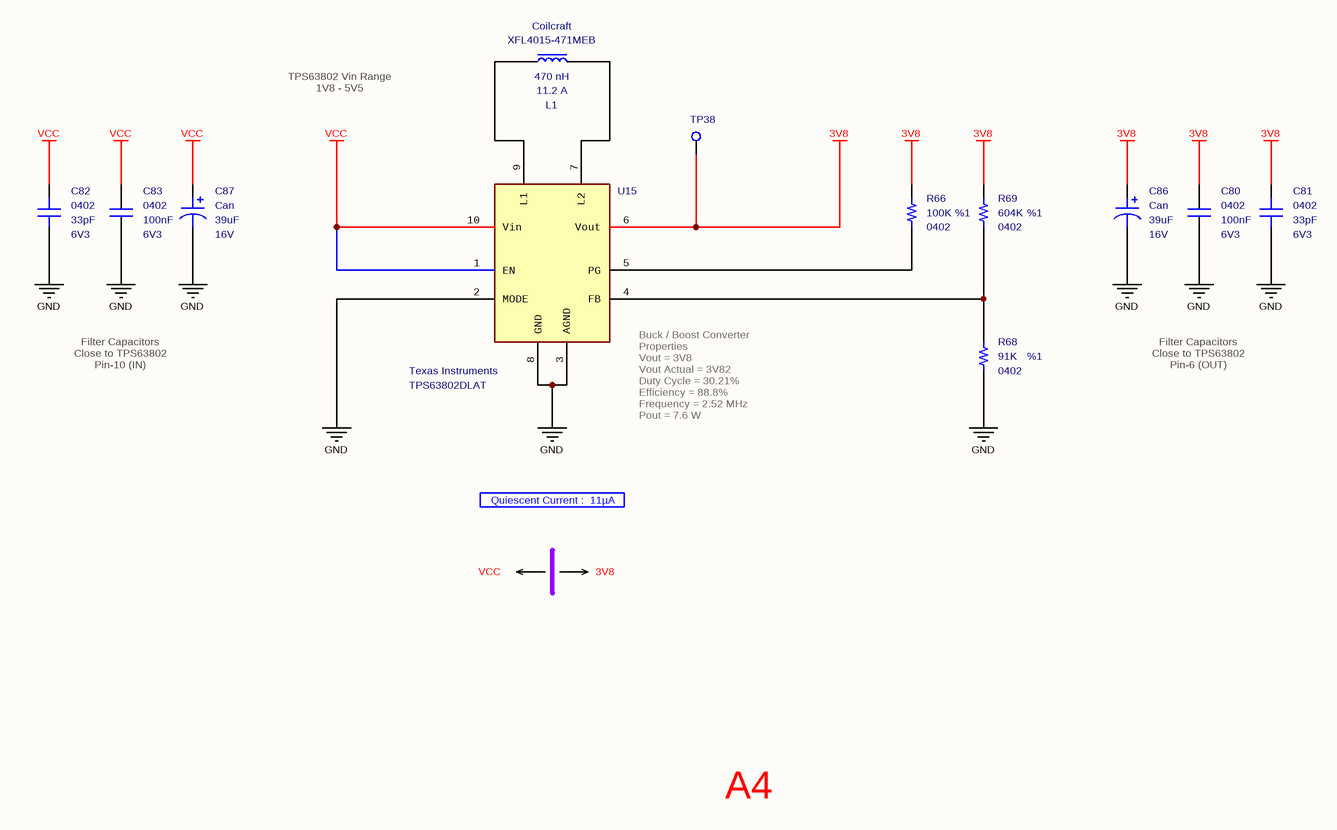
[diagram p32: Buck Boost Converter.SchDoc]

### Parts
C80  value 100nF  Case: 0402  Voltage: 6V3  [CAPACITOR_0402]  (hidden comment: Multilayer Ceramic Capacitor)
C81  value 33pF  Case: 0402  Voltage: 6V3  [CAPACITOR_0402]  (hidden comment: Multilayer Ceramic Capacitor)
C82  value 33pF  Case: 0402  Voltage: 6V3  [CAPACITOR_0402]  (hidden comment: Multilayer Ceramic Capacitor)
C83  value 100nF  Case: 0402  Voltage: 6V3  [CAPACITOR_0402]  (hidden comment: Multilayer Ceramic Capacitor)
C86  value 39uF  Case: Can  Voltage: 16V  [CAPACITOR_CAN-B6]  (hidden comment: Aluminium Organic Polymer Capacitors)
C87  value 39uF  Case: Can  Voltage: 16V  [CAPACITOR_CAN-B6]  (hidden comment: Aluminium Organic Polymer Capacitors)
L1  value 470 nH  Maximum DC Current: 11.2 A  Manufacturer_Part_Number: XFL4015-471MEB  Manufacturer_Name: Coilcraft  [INDUCTOR_XFL4015]  (hidden comment: Fixed Inductor)
R66  value 100K  Tolerance: %1  Case: 0402  [RESISTOR_0402]  (hidden comment: Thick Film Resistor)
R68  value 91K  Tolerance: %1  Case: 0402  [RESISTOR_0402]  (hidden comment: Thick Film Resistor)
R69  value 604K  Tolerance: %1  Case: 0402  [RESISTOR_0402]  (hidden comment: Thick Film Resistor)
TP38  PCB - Test Point  [Test_Pad - Hole]  (value not drawn)  (no BOM)
U15  Manufacturer_Part_Number: TPS63802DLAT  Manufacturer_Name: Texas Instruments  [VSON-10]  (hidden comment: Buck-Boost Converter)

### Nets
3V8: C80.1 C81.2 C86.1 R66.2 R69.2 TP38.1 U15.6(Vout)
GND: C80.2 C81.1 C82.1 C83.2 C86.2 C87.2 R68.1 U15.2(MODE) U15.3(AGND) U15.8(GND)
VCC: C82.2 C83.1 C87.1 U15.1(EN) U15.10(Vin)
NetL1_1: L1.1 U15.9(L1)
NetL1_2: L1.2 U15.7(L2)
NetR66_1: R66.1 U15.5(PG)
NetR68_2: R68.2 R69.1 U15.4(FB)

### Notes on the sheet
- TPS63802 Vin Range
  1V8 - 5V5
- Filter Capacitors
  Close to TPS63802
  Pin-10 (IN)
- Filter Capacitors
  Close to TPS63802
  Pin-6 (OUT)
- (near U15) Buck / Boost Converter Properties
  Vout = 3V8
  Vout Actual = 3V82
  Duty Cycle = 30.21%
  Efficiency = 88.8%
  Frequency = 2.52 MHz
  Pout = 7.6 W
- Quiescent Current :  11µA
- VCC
- 3V8
- A4
- Title
- Size:
- Date:
- Number:
- Time:
- Revision:
- Sheet
- of
- File:

### Library data of the parts
C80 C83 = Capacitor - 100nF [0402-6V3]: as C88 on sheet Battery Measurement; Height: 0.25mm; Mouser_Part_Number: 581-04026D104KAT4A; ComponentLink1Description: Mouser; ComponentLink1URL: https://www.mouser.com.tr/ProductDetail/AVX/04026D104KAT4A?qs=sGAEpiMZZMs0AnBnWHyRQPg4iYkCw7IMED%2F4kpqgf7w%3D; ComponentLink2Description: DataSheet; ComponentLink2URL: https://www.mouser.com.tr/datasheet/2/40/cx5r-776519.pdf; ROHS: Yes; Maximum Operating Temperature: +85; Minimum Operating Temperature: -55; Supplier 1: Avnet; Supplier Part Number 1: 04026D104KAT4A
C81 C82 = Capacitor - 33pF [0402-6V3]: as C97 on sheet Battery Measurement; Height: 0.5mm; Mouser_Part_Number: 80-C0402C330J9RAUTO; Maximum Operating Temperature: +125; Minimum Operating Temperature: -55; ROHS: Yes; ComponentLink1Description: DataSheet; ComponentLink1URL: https://api.kemet.com/component-edge/download/datasheet/C0402C330J9RACAUTO.pdf; ComponentLink2Description: Mouser; ComponentLink2URL: https://www.mouser.com/Search/Refine.aspx?Keyword=80-C0402C330J9RAUTO; Supplier 1: Mouser; Supplier Part Number 1: 80-C0402C330J9RAUTO
C86 C87 = Capacitor - 39uF [Can-16V]: Capacitor - 39uF 16V [Can] (Electrolytic); Manufacturer_Name: Panasonic; Manufacturer_Part_Number: 16SVPC39MV; Leakage Current: 300uA; Tolerance: 20%; ESR: 27 mOhms; Height: 6mm; Mouser_Part_Number: 667-16SVPC39MV; Maximum Operating Temperature: +105; Minimum Operating Temperature: -55; ROHS: Yes; ComponentLink1Description: DataSheet; ComponentLink1URL: https://www.mouser.com.tr/datasheet/2/315/SVPC_OS-1197065.pdf; ComponentLink2Description: Mouser; ComponentLink2URL: https://www.mouser.com.tr/ProductDetail/Panasonic/16SVPC39MV?qs=%2Fha2pyFadujpu3ATUg5hwJ6EWbTfmGGWJDu5kzoHUqwaZzNIr7t5GA%3D%3D; Supplier 1: Mouser; Supplier 2: Digi-Key; Supplier Part Number 2: P16473CT-ND; Supplier Part Number 1: 667-16SVPC39MV
L1 = Inductor - 470 nH [SMD]: Fixed Inductors 0.47uH 20% 11.2A 8.36mOhms AEC-Q200; Height: 1.6mm; Mouser_Part_Number: 994-XFL4015-471MEB; ComponentLink1Description: DataSheet; ComponentLink1URL: https://eu.mouser.com/datasheet/2/597/xfl4015-270755.pdf; ComponentLink2Description: Mouser; ComponentLink2URL: https://eu.mouser.com/ProductDetail/Coilcraft/XFL4015-471MEB?qs=VJjuEbE9QBO6UaDdUAgr%252Bw%3D%3D; Maximum DC Resistance: 8.36 mOhms; Maximum Operating Temperature: +125; Minimum Operating Temperature: -40; Tolerance: 20%; Supplier 1: Mouser; Supplier 2: Farnell; Supplier 3: Digi-Key; Supplier 4: Newark; Supplier Part Number 1: 710-7443551130; Supplier Part Number 2: 1869775; Supplier Part Number 4: 32T8562; Supplier Part Number 3: 732-1124-1-ND; Case: XFL4015
R66 = Resistor - 100K: Thick Film Resistors - SMD 1/16 W 100 Kohms 1%; Manufacturer_Name: Vishay; Manufacturer_Part_Number: CRCW0402100KFKED; Height: 0.35mm; Mouser_Part_Number: 71-CRCW0402-100K-E3; ComponentLink1Description: DataSheet; ComponentLink1URL: https://www.mouser.com.tr/datasheet/2/427/dcrcwe3-1762152.pdf; ComponentLink2Description: Mouser; ComponentLink2URL: https://eu.mouser.com/ProductDetail/Vishay-Dale/CRCW0402100KFKED?qs=OlqPY1CiralZGKRwQ4Glcg%3D%3D; Supplier 1: Future Electronics; Supplier 2: Future Electronics; Supplier 3: Arrow; Supplier 4: Farnell; Supplier 5: Digi-Key; Supplier Part Number 1: CRCW0402100KFKED-CUTT; Supplier Part Number 2: CRCW0402100KFKED-REEL; Supplier Part Number 3: CRCW0402100KFKED; Supplier Part Number 4: 2121857; Supplier Part Number 5: 541-100KLCT-ND
R68 = Resistor - 91K: Thick Film Resistors - SMD 1/16 W 91 Kohms 1%; Manufacturer_Name: Vishay; Manufacturer_Part_Number: CRCW040291K0FKED; Height: 0.35mm; Mouser_Part_Number: 71-CRCW040291K0FKED; ComponentLink1Description: DataSheet; ComponentLink1URL: https://eu.mouser.com/datasheet/2/427/dcrcwe3-1762152.pdf; ComponentLink2Description: Mouser; ComponentLink2URL: https://eu.mouser.com/ProductDetail/Vishay-Dale/CRCW040291K0FKED?qs=Po1ctqG%2F82oNfd9H7rZeFQ%3D%3D; Supplier 1: Future Electronics; Supplier 2: Arrow; Supplier 3: Farnell; Supplier 4: Newark; Supplier 5: Digi-Key; Supplier Part Number 1: CRCW040291K0FKED-REEL; Supplier Part Number 2: CRCW040291K0FKED; Supplier Part Number 3: 2121853; Supplier Part Number 4: 24W2519; Supplier Part Number 5: 541-91.0KLCT-ND
R69 = Resistor - 604K: Thick Film Resistors - SMD 1/16 W 604 Kohms 1%; Manufacturer_Name: Vishay; Manufacturer_Part_Number: CRCW0402604KFKED; Height: 0.35mm; Mouser_Part_Number: 71-CRCW0402-604K-E3; ComponentLink1Description: DataSheet; ComponentLink1URL: https://eu.mouser.com/datasheet/2/427/dcrcwe3-1762152.pdf; ComponentLink2Description: Mouser; ComponentLink2URL: https://eu.mouser.com/ProductDetail/Vishay-Dale/CRCW0402604KFKED?qs=DKbL89i6OEpzv5ZGRZfINw%3D%3D; Supplier 1: Mouser; Supplier 2: Digi-Key; Supplier Part Number 1: 71-CRCW0402390KFKED; Supplier Part Number 2: 541-390KLCT-ND
TP38 = PCB - Test Point: Test Point
U15 = IC - TPS63802DLAT: Switching Voltage Regulators High current, high efficiency single inductor buck-boost converter 10-VSON-HR -40 to 125; Mouser_Part_Number: 595-TPS63802DLAT; ComponentLink1Description: DataSheet; ComponentLink1URL: https://www.mouser.com.tr/datasheet/2/256/MAX17055-1097125.pdf; ComponentLink2Description: Mouser; ComponentLink2URL: https://www.mouser.com.tr/ProductDetail/Maxim-Integrated/MAX17055ETB%2bT?qs=sGAEpiMZZMve4%2FbfQkoj%252BAs6FTSsQJaJrD7Z3v0Qe9M%3D; Minimum Operating Temperature: -40; Maximum Operating Temperature: +125; Supplier 1: Avnet; Supplier 2: Mouser; Supplier 3: Digi-Key; Supplier Part Number 1: TPS63802DLAT; Supplier Part Number 2: 595-TPS63802DLAT; Supplier Part Number 3: 296-TPS63802DLATCT-ND; Case: VSON-10

## Sheet I2C Sensor Network.SchDoc: I2C Sensor Network
size A4; ApprovedBy: Mehmet Günce Akkoyun; CheckedBy: Mehmet Günce Akkoyun; Author: Mehmet Günce Akkoyun; CompanyName: Ovoo Electronics; DrawnBy: Mehmet Günce Akkoyun; Engineer: Mehmet Günce Akkoyun; Organization: Ovoo Electronics; Address1: Küçük Ýhsaniye Mah.; Address2: Mýzraklý Sok. No:15; Address3: Meram / Konya; Address4: Turkiye; DocumentNumber: AA005; Revision: B106AA; SheetNumber: 28; SheetTotal: 37
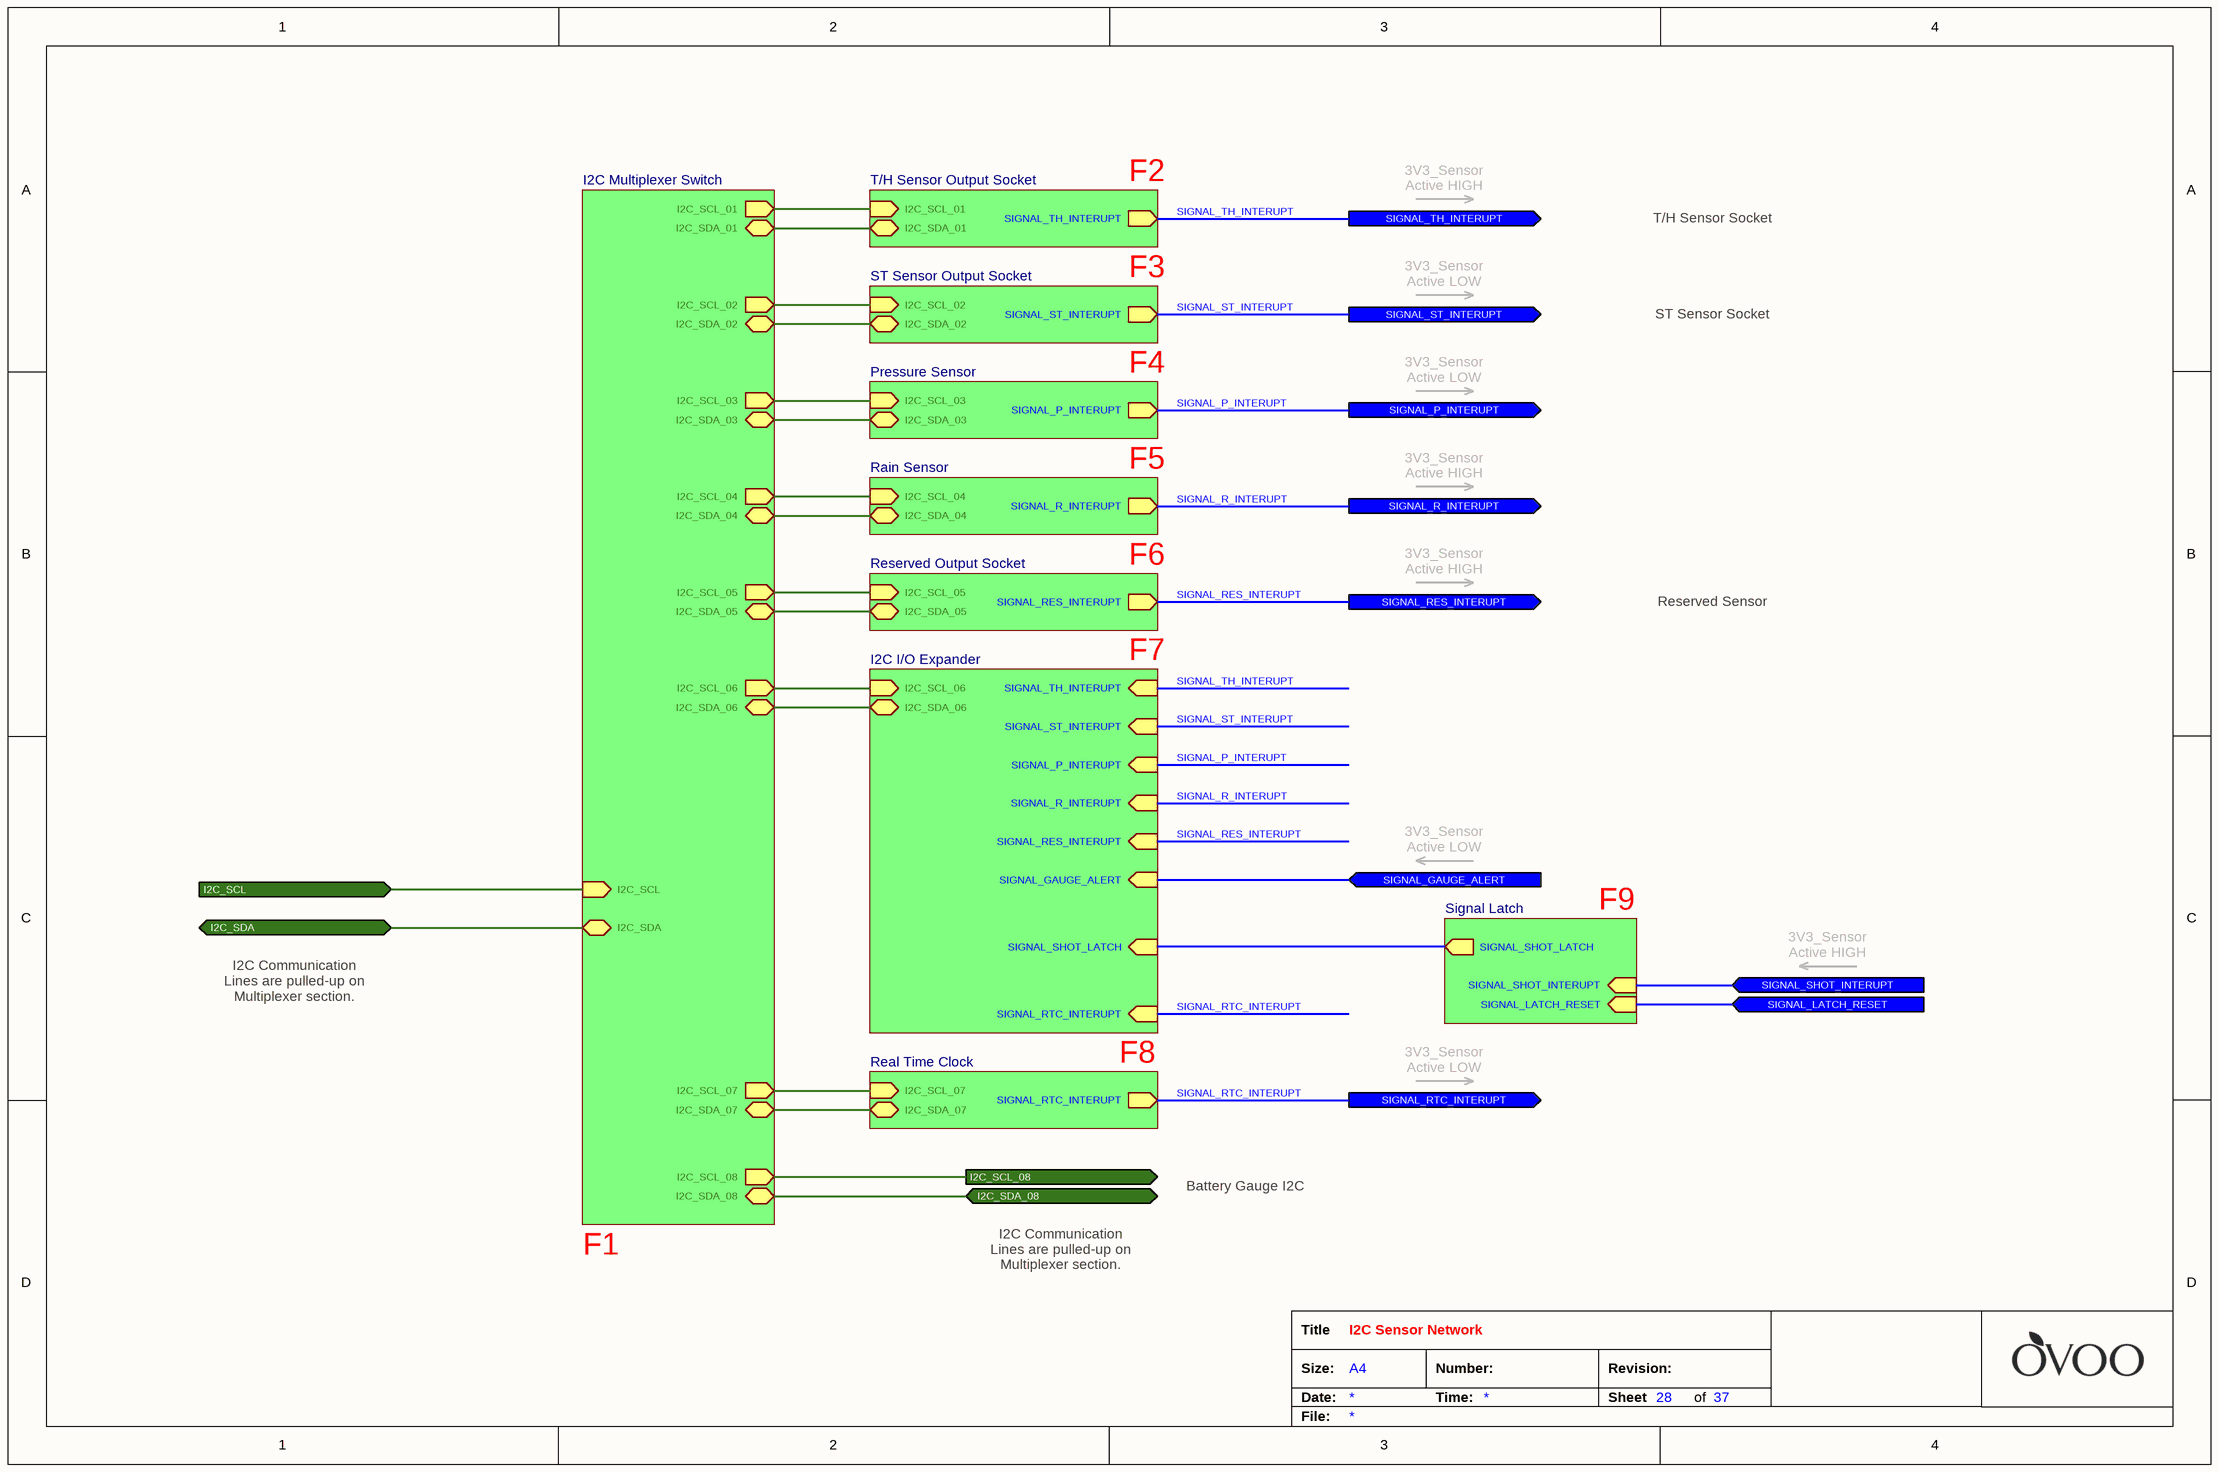
[diagram p33: I2C Sensor Network.SchDoc]

### Sub-sheets
I2C I/O Expander = I2C IO Expander.SchDoc: I2C_SCL_06 (in), SIGNAL_R_INTERUPT (in), I2C_SDA_06 (bidir), SIGNAL_RES_INTERUPT (in), SIGNAL_P_INTERUPT (in), SIGNAL_ST_INTERUPT (in), SIGNAL_TH_INTERUPT (in), SIGNAL_GAUGE_ALERT (in), SIGNAL_RTC_INTERUPT (in), SIGNAL_SHOT_LATCH (in)
I2C Multiplexer Switch = I2C Multiplexer.SchDoc: I2C_SDA_02 (bidir), I2C_SCL_07 (out), I2C_SCL (in), I2C_SCL_01 (out), I2C_SDA_06 (bidir), I2C_SCL_03 (out), I2C_SCL_05 (out), I2C_SCL_04 (out), I2C_SDA_05 (bidir), I2C_SDA_08 (bidir), I2C_SDA_01 (bidir), I2C_SDA_03 (bidir), I2C_SDA_04 (bidir), I2C_SCL_08 (out), I2C_SCL_02 (out), I2C_SDA_07 (bidir), I2C_SDA (bidir), I2C_SCL_06 (out)
Pressure Sensor = Pressure Sensor.SchDoc: SIGNAL_P_INTERUPT (out), I2C_SCL_03 (in), I2C_SDA_03 (bidir)
Rain Sensor = Capacitive Rain Sensor.SchDoc: I2C_SCL_04 (in), I2C_SDA_04 (bidir), SIGNAL_R_INTERUPT (out)
Real Time Clock = Real Time Clock.SchDoc: I2C_SDA_07 (bidir), I2C_SCL_07 (in), SIGNAL_RTC_INTERUPT (out)
Reserved Output Socket = Reserved Sensor Output Socket.SchDoc: SIGNAL_RES_INTERUPT (out), I2C_SCL_05 (in), I2C_SDA_05 (bidir)
Signal Latch = Signal Latch Logic.SchDoc: SIGNAL_SHOT_LATCH (out), SIGNAL_SHOT_INTERUPT (in), SIGNAL_LATCH_RESET (in)
ST Sensor Output Socket = ST Sensor Output Socket.SchDoc: I2C_SCL_02 (in), I2C_SDA_02 (bidir), SIGNAL_ST_INTERUPT (out)
T/H Sensor Output Socket = TH Sensor Output Socket.SchDoc: I2C_SCL_01 (in), I2C_SDA_01 (bidir), SIGNAL_TH_INTERUPT (out)

### Ports
I2C_SCL (in), I2C_SCL_08 (out), I2C_SDA (bidir), I2C_SDA_08 (bidir), SIGNAL_GAUGE_ALERT (in), SIGNAL_LATCH_RESET (in), SIGNAL_P_INTERUPT (out), SIGNAL_R_INTERUPT (out), SIGNAL_RES_INTERUPT (out), SIGNAL_RTC_INTERUPT (out), SIGNAL_SHOT_INTERUPT (in), SIGNAL_ST_INTERUPT (out), SIGNAL_TH_INTERUPT (out)

### Nets
I2C_SCL: port I2C_SCL, sheet I2C Multiplexer Switch/I2C_SCL
I2C_SCL_01: sheet I2C Multiplexer Switch/I2C_SCL_01, sheet T/H Sensor Output Socket/I2C_SCL_01
I2C_SCL_02: sheet I2C Multiplexer Switch/I2C_SCL_02, sheet ST Sensor Output Socket/I2C_SCL_02
I2C_SCL_03: sheet I2C Multiplexer Switch/I2C_SCL_03, sheet Pressure Sensor/I2C_SCL_03
I2C_SCL_04: sheet I2C Multiplexer Switch/I2C_SCL_04, sheet Rain Sensor/I2C_SCL_04
I2C_SCL_05: sheet I2C Multiplexer Switch/I2C_SCL_05, sheet Reserved Output Socket/I2C_SCL_05
I2C_SCL_06: sheet I2C Multiplexer Switch/I2C_SCL_06, sheet I2C I/O Expander/I2C_SCL_06
I2C_SCL_07: sheet I2C Multiplexer Switch/I2C_SCL_07, sheet Real Time Clock/I2C_SCL_07
I2C_SCL_08: port I2C_SCL_08, sheet I2C Multiplexer Switch/I2C_SCL_08
I2C_SDA: port I2C_SDA, sheet I2C Multiplexer Switch/I2C_SDA
I2C_SDA_01: sheet I2C Multiplexer Switch/I2C_SDA_01, sheet T/H Sensor Output Socket/I2C_SDA_01
I2C_SDA_02: sheet I2C Multiplexer Switch/I2C_SDA_02, sheet ST Sensor Output Socket/I2C_SDA_02
I2C_SDA_03: sheet I2C Multiplexer Switch/I2C_SDA_03, sheet Pressure Sensor/I2C_SDA_03
I2C_SDA_04: sheet I2C Multiplexer Switch/I2C_SDA_04, sheet Rain Sensor/I2C_SDA_04
I2C_SDA_05: sheet I2C Multiplexer Switch/I2C_SDA_05, sheet Reserved Output Socket/I2C_SDA_05
I2C_SDA_06: sheet I2C Multiplexer Switch/I2C_SDA_06, sheet I2C I/O Expander/I2C_SDA_06
I2C_SDA_07: sheet I2C Multiplexer Switch/I2C_SDA_07, sheet Real Time Clock/I2C_SDA_07
I2C_SDA_08: port I2C_SDA_08, sheet I2C Multiplexer Switch/I2C_SDA_08
SIGNAL_GAUGE_ALERT: port SIGNAL_GAUGE_ALERT, sheet I2C I/O Expander/SIGNAL_GAUGE_ALERT
SIGNAL_P_INTERUPT: port SIGNAL_P_INTERUPT, sheet Pressure Sensor/SIGNAL_P_INTERUPT, sheet I2C I/O Expander/SIGNAL_P_INTERUPT
SIGNAL_R_INTERUPT: port SIGNAL_R_INTERUPT, sheet Rain Sensor/SIGNAL_R_INTERUPT, sheet I2C I/O Expander/SIGNAL_R_INTERUPT
SIGNAL_RES_INTERUPT: port SIGNAL_RES_INTERUPT, sheet I2C I/O Expander/SIGNAL_RES_INTERUPT, sheet Reserved Output Socket/SIGNAL_RES_INTERUPT
SIGNAL_RTC_INTERUPT: port SIGNAL_RTC_INTERUPT, sheet Real Time Clock/SIGNAL_RTC_INTERUPT, sheet I2C I/O Expander/SIGNAL_RTC_INTERUPT
SIGNAL_SHOT_INTERUPT: port SIGNAL_SHOT_INTERUPT, sheet Signal Latch/SIGNAL_SHOT_INTERUPT
SIGNAL_SHOT_LATCH: sheet I2C I/O Expander/SIGNAL_SHOT_LATCH, sheet Signal Latch/SIGNAL_SHOT_LATCH
SIGNAL_ST_INTERUPT: port SIGNAL_ST_INTERUPT, sheet ST Sensor Output Socket/SIGNAL_ST_INTERUPT, sheet I2C I/O Expander/SIGNAL_ST_INTERUPT
SIGNAL_TH_INTERUPT: port SIGNAL_TH_INTERUPT, sheet T/H Sensor Output Socket/SIGNAL_TH_INTERUPT, sheet I2C I/O Expander/SIGNAL_TH_INTERUPT
NetC93_2: port SIGNAL_LATCH_RESET, sheet Signal Latch/SIGNAL_LATCH_RESET

### Notes on the sheet
- F2
- 3V3_Sensor
  Active HIGH
- T/H Sensor Socket
- F3
- 3V3_Sensor
  Active LOW
- ST Sensor Socket
- F4
- F5
- F6
- Reserved Sensor Socket
- F7
- F9
- I2C Communication Lines are pulled-up on Multiplexer section.
- F8
- Battery Gauge I2C
- F1
- Title
- Size:
- Date:
- A4
- Number:
- Time:
- Revision:
- Sheet
- of
- File:

## Sheet I2C Multiplexer.SchDoc: I2C 8 Channel Multiplexer
size A3; ApprovedBy: Mehmet Günce Akkoyun; CheckedBy: Mehmet Günce Akkoyun; Author: Mehmet Günce Akkoyun; CompanyName: Ovoo Electronics; DrawnBy: Mehmet Günce Akkoyun; Engineer: Mehmet Günce Akkoyun; Organization: Ovoo Electronics; Address1: Küçük Ýhsaniye Mah.; Address2: Mýzraklý Sok. No:15; Address3: Meram / Konya; Address4: Turkiye; DocumentNumber: AA005; Revision: B106AA; SheetNumber: 29; SheetTotal: 37
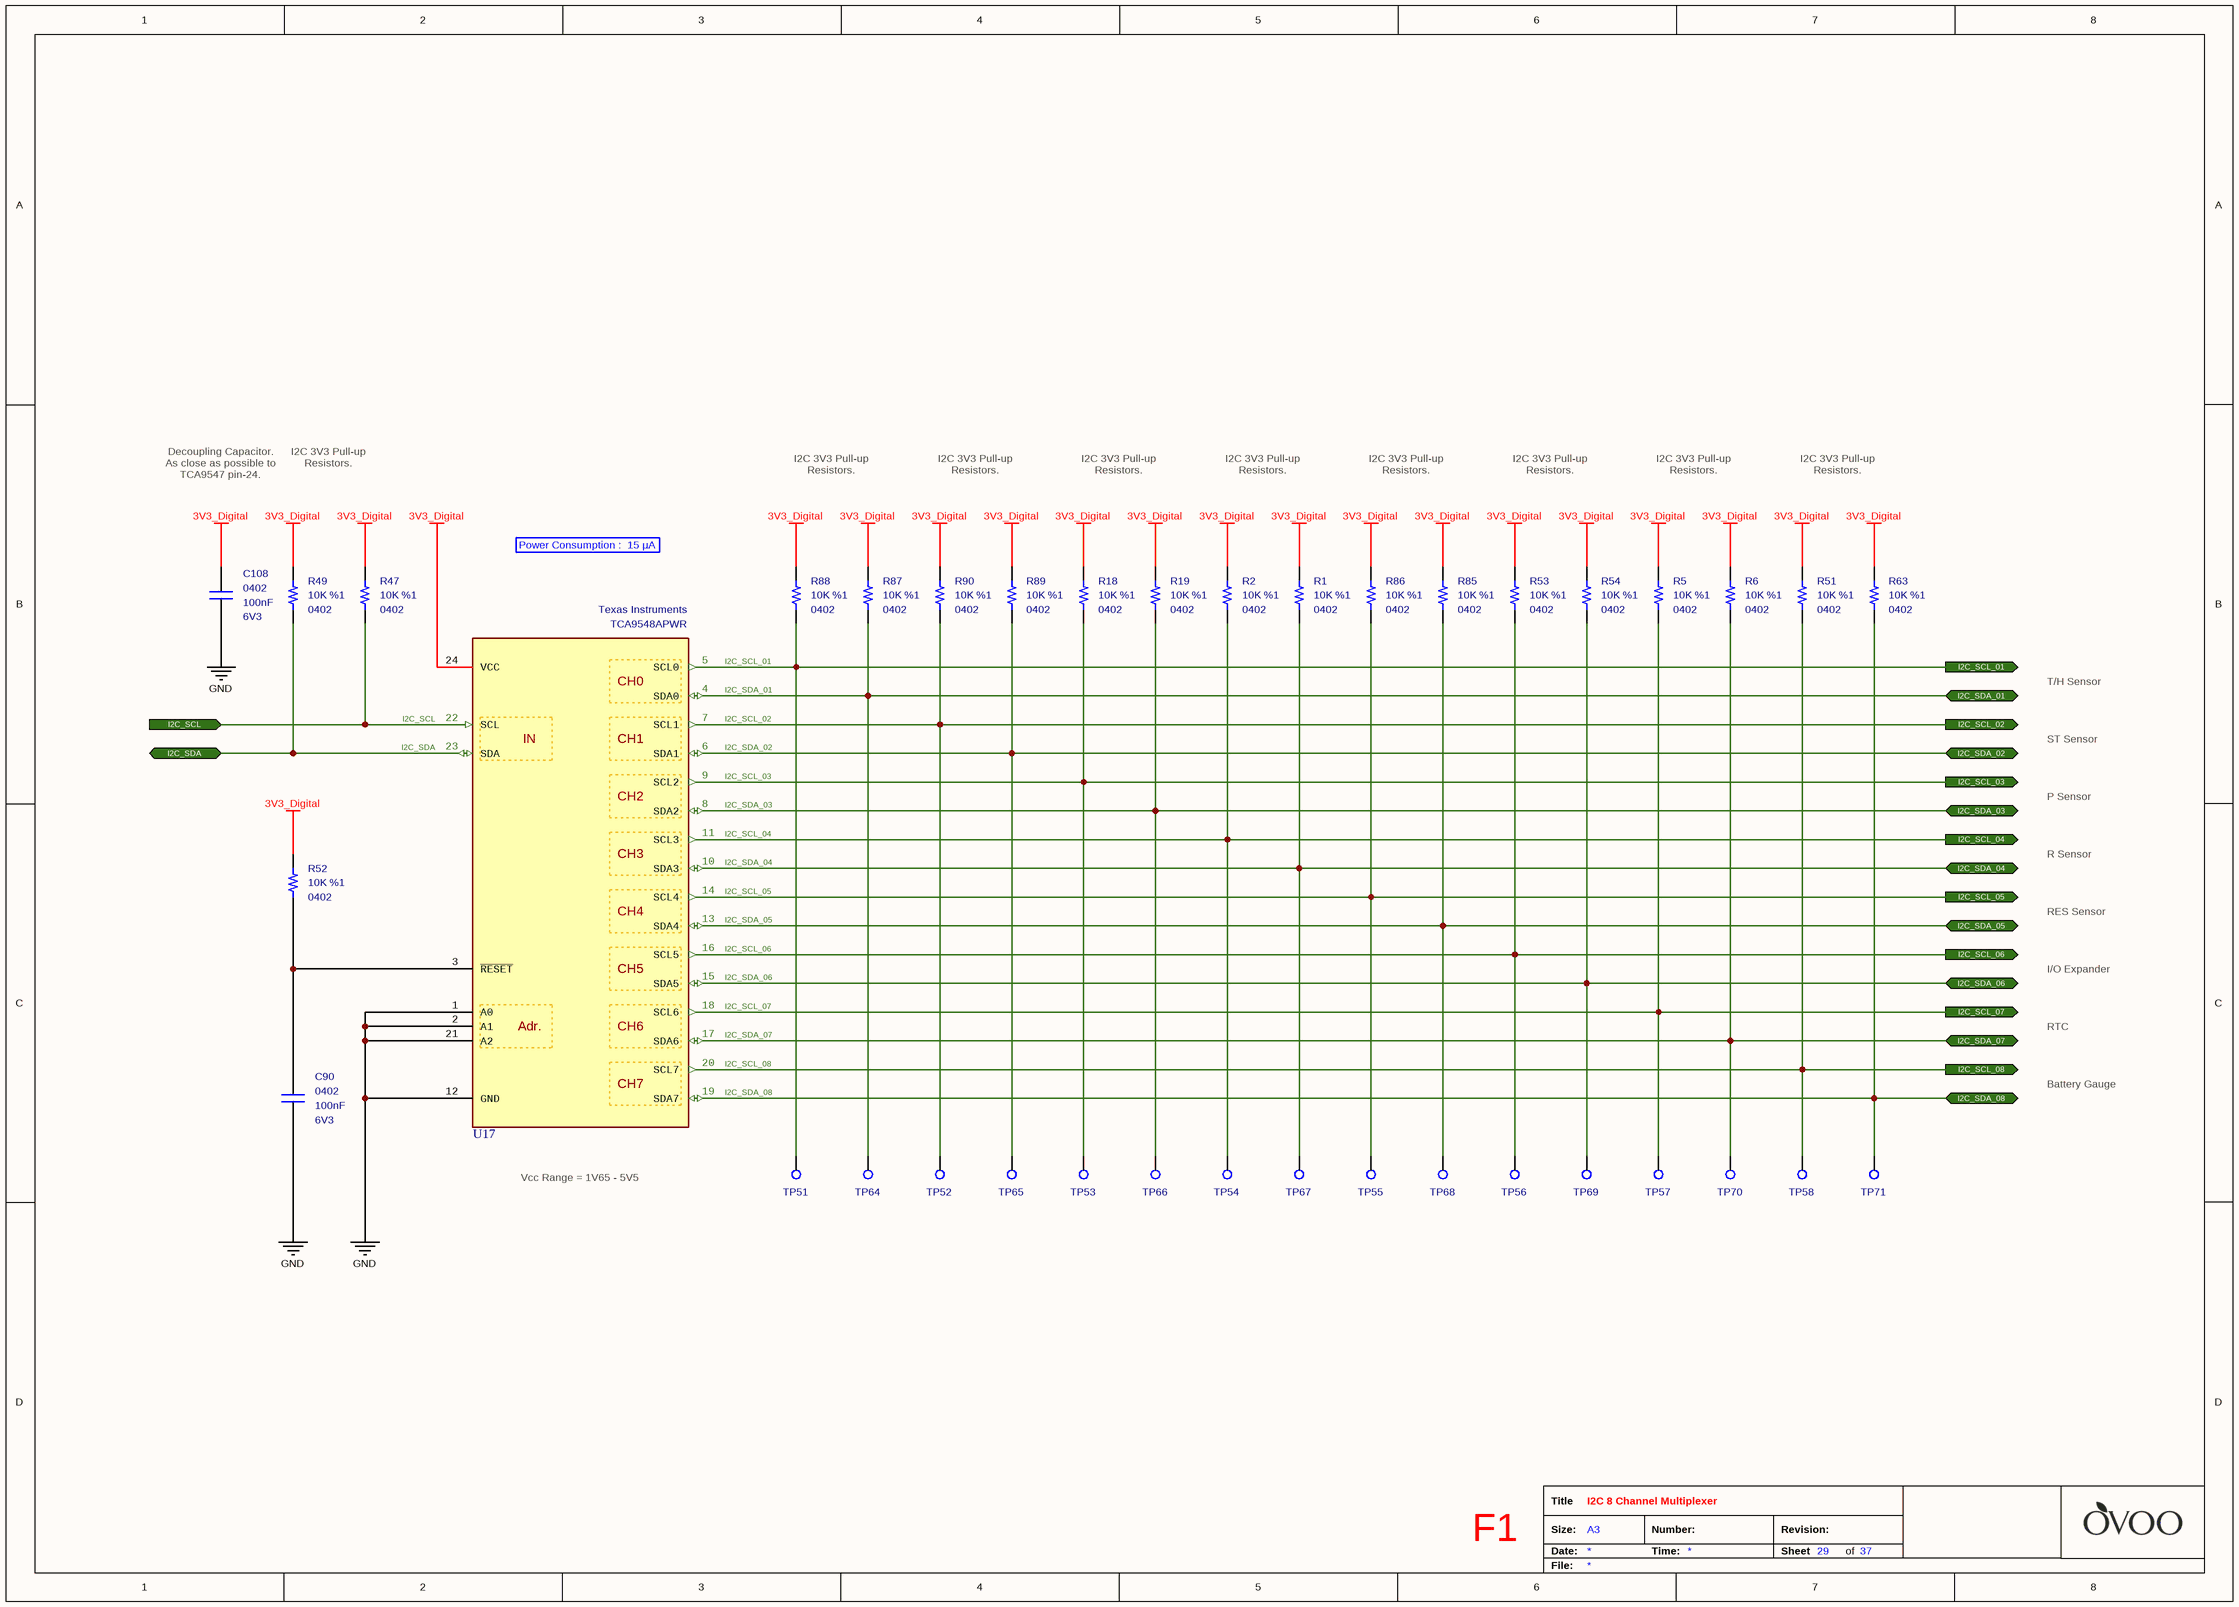
[diagram p34: I2C Multiplexer.SchDoc]

### Parts
C90  value 100nF  Case: 0402  Voltage: 6V3  [CAPACITOR_0402]  (hidden comment: Multilayer Ceramic Capacitor)
C108  value 100nF  Case: 0402  Voltage: 6V3  [CAPACITOR_0402]  (hidden comment: Multilayer Ceramic Capacitor)
R1  value 10K  Tolerance: %1  Case: 0402  [RESISTOR_0402]  (hidden comment: Thick Film Resistor)
R2  value 10K  Tolerance: %1  Case: 0402  [RESISTOR_0402]  (hidden comment: Thick Film Resistor)
R5  value 10K  Tolerance: %1  Case: 0402  [RESISTOR_0402]  (hidden comment: Thick Film Resistor)
R6  value 10K  Tolerance: %1  Case: 0402  [RESISTOR_0402]  (hidden comment: Thick Film Resistor)
R18  value 10K  Tolerance: %1  Case: 0402  [RESISTOR_0402]  (hidden comment: Thick Film Resistor)
R19  value 10K  Tolerance: %1  Case: 0402  [RESISTOR_0402]  (hidden comment: Thick Film Resistor)
R47  value 10K  Tolerance: %1  Case: 0402  [RESISTOR_0402]  (hidden comment: Thick Film Resistor)
R49  value 10K  Tolerance: %1  Case: 0402  [RESISTOR_0402]  (hidden comment: Thick Film Resistor)
R51  value 10K  Tolerance: %1  Case: 0402  [RESISTOR_0402]  (hidden comment: Thick Film Resistor)
R52  value 10K  Tolerance: %1  Case: 0402  [RESISTOR_0402]  (hidden comment: Thick Film Resistor)
R53  value 10K  Tolerance: %1  Case: 0402  [RESISTOR_0402]  (hidden comment: Thick Film Resistor)
R54  value 10K  Tolerance: %1  Case: 0402  [RESISTOR_0402]  (hidden comment: Thick Film Resistor)
R63  value 10K  Tolerance: %1  Case: 0402  [RESISTOR_0402]  (hidden comment: Thick Film Resistor)
R85  value 10K  Tolerance: %1  Case: 0402  [RESISTOR_0402]  (hidden comment: Thick Film Resistor)
R86  value 10K  Tolerance: %1  Case: 0402  [RESISTOR_0402]  (hidden comment: Thick Film Resistor)
R87  value 10K  Tolerance: %1  Case: 0402  [RESISTOR_0402]  (hidden comment: Thick Film Resistor)
R88  value 10K  Tolerance: %1  Case: 0402  [RESISTOR_0402]  (hidden comment: Thick Film Resistor)
R89  value 10K  Tolerance: %1  Case: 0402  [RESISTOR_0402]  (hidden comment: Thick Film Resistor)
R90  value 10K  Tolerance: %1  Case: 0402  [RESISTOR_0402]  (hidden comment: Thick Film Resistor)
TP51  PCB - Test Point  [Test_Pad - Hole]  (value not drawn)  (no BOM)
TP52  PCB - Test Point  [Test_Pad - Hole]  (value not drawn)  (no BOM)
TP53  PCB - Test Point  [Test_Pad - Hole]  (value not drawn)  (no BOM)
TP54  PCB - Test Point  [Test_Pad - Hole]  (value not drawn)  (no BOM)
TP55  PCB - Test Point  [Test_Pad - Hole]  (value not drawn)  (no BOM)
TP56  PCB - Test Point  [Test_Pad - Hole]  (value not drawn)  (no BOM)
TP57  PCB - Test Point  [Test_Pad - Hole]  (value not drawn)  (no BOM)
TP58  PCB - Test Point  [Test_Pad - Hole]  (value not drawn)  (no BOM)
TP64  PCB - Test Point  [Test_Pad - Hole]  (value not drawn)  (no BOM)
TP65  PCB - Test Point  [Test_Pad - Hole]  (value not drawn)  (no BOM)
TP66  PCB - Test Point  [Test_Pad - Hole]  (value not drawn)  (no BOM)
TP67  PCB - Test Point  [Test_Pad - Hole]  (value not drawn)  (no BOM)
TP68  PCB - Test Point  [Test_Pad - Hole]  (value not drawn)  (no BOM)
TP69  PCB - Test Point  [Test_Pad - Hole]  (value not drawn)  (no BOM)
TP70  PCB - Test Point  [Test_Pad - Hole]  (value not drawn)  (no BOM)
TP71  PCB - Test Point  [Test_Pad - Hole]  (value not drawn)  (no BOM)
U17  Manufacturer_Part_Number: TCA9548APWR  Manufacturer_Name: Texas Instruments  [TSSOP-24]  (hidden comment: I2C Switch IC)

### Ports
I2C_SCL (in), I2C_SCL_01 (out), I2C_SCL_02 (out), I2C_SCL_03 (out), I2C_SCL_04 (out), I2C_SCL_05 (out), I2C_SCL_06 (out), I2C_SCL_07 (out), I2C_SCL_08 (out), I2C_SDA (bidir), I2C_SDA_01 (bidir), I2C_SDA_02 (bidir), I2C_SDA_03 (bidir), I2C_SDA_04 (bidir), I2C_SDA_05 (bidir), I2C_SDA_06 (bidir), I2C_SDA_07 (bidir), I2C_SDA_08 (bidir)

### Nets
3V3_Digital: C108.2 R1.2 R2.2 R5.2 R6.2 R18.2 R19.2 R47.2 R49.2 R51.2 R52.2 R53.2 R54.2 R63.2 R85.2 R86.2 R87.2 R88.2 R89.2 R90.2 U17.24(VCC)
GND: C90.1 C108.1 U17.1(A0) U17.2(A1) U17.12(GND) U17.21(A2)
I2C_SCL: R47.1 U17.22(SCL) ; port I2C_SCL
I2C_SCL_01: R88.1 TP51.1 U17.5(SCL0) ; port I2C_SCL_01
I2C_SCL_02: R90.1 TP52.1 U17.7(SCL1) ; port I2C_SCL_02
I2C_SCL_03: R18.1 TP53.1 U17.9(SCL2) ; port I2C_SCL_03
I2C_SCL_04: R2.1 TP54.1 U17.11(SCL3) ; port I2C_SCL_04
I2C_SCL_05: R86.1 TP55.1 U17.14(SCL4) ; port I2C_SCL_05
I2C_SCL_06: R53.1 TP56.1 U17.16(SCL5) ; port I2C_SCL_06
I2C_SCL_07: R5.1 TP57.1 U17.18(SCL6) ; port I2C_SCL_07
I2C_SCL_08: R51.1 TP58.1 U17.20(SCL7) ; port I2C_SCL_08
I2C_SDA: R49.1 U17.23(SDA) ; port I2C_SDA
I2C_SDA_01: R87.1 TP64.1 U17.4(SDA0) ; port I2C_SDA_01
I2C_SDA_02: R89.1 TP65.1 U17.6(SDA1) ; port I2C_SDA_02
I2C_SDA_03: R19.1 TP66.1 U17.8(SDA2) ; port I2C_SDA_03
I2C_SDA_04: R1.1 TP67.1 U17.10(SDA3) ; port I2C_SDA_04
I2C_SDA_05: R85.1 TP68.1 U17.13(SDA4) ; port I2C_SDA_05
I2C_SDA_06: R54.1 TP69.1 U17.15(SDA5) ; port I2C_SDA_06
I2C_SDA_07: R6.1 TP70.1 U17.17(SDA6) ; port I2C_SDA_07
I2C_SDA_08: R63.1 TP71.1 U17.19(SDA7) ; port I2C_SDA_08
NetC90_2: C90.2 R52.1 U17.3(~{RESET})

### Notes on the sheet
- Decoupling Capacitor. As close as possible to TCA9547 pin-24.
- I2C 3V3 Pull-up Resistors.
- Power Consumption :  15 μA
- T/H Sensor
- ST Sensor
- P Sensor
- R Sensor
- RES Sensor
- I/O Expander
- RTC
- Battery Gauge
- Vcc Range = 1V65 - 5V5
- F1
- Title
- Size:
- Date:
- A3
- Number:
- Time:
- Revision:
- Sheet
- of
- File:
- (in symbol IC - TCA9548APWR) CH0; IN; CH1; CH2; CH3; CH4; CH5; Adr.; CH6; CH7

### Library data of the parts
C90 C108 = Capacitor - 100nF [0402-6V3]: as C88 on sheet Battery Measurement; Height: 0.25mm; Mouser_Part_Number: 581-04026D104KAT4A; ComponentLink1Description: Mouser; ComponentLink1URL: https://www.mouser.com.tr/ProductDetail/AVX/04026D104KAT4A?qs=sGAEpiMZZMs0AnBnWHyRQPg4iYkCw7IMED%2F4kpqgf7w%3D; ComponentLink2Description: DataSheet; ComponentLink2URL: https://www.mouser.com.tr/datasheet/2/40/cx5r-776519.pdf; ROHS: Yes; Maximum Operating Temperature: +85; Minimum Operating Temperature: -55; Supplier 1: Avnet; Supplier Part Number 1: 04026D104KAT4A
R1 R2 R5 R6 R18 R19 R47 R49 R51-R54 R63 R85-R90 = Resistor - 10K: as R71 on sheet Battery Measurement; Height: 0.4mm; Mouser_Part_Number: 71-CRCW0402-10K-E3; ComponentLink1Description: DataSheet; ComponentLink1URL: https://www.mouser.com.tr/datasheet/2/427/dcrcwe3-1762152.pdf; ComponentLink2Description: Mouser; ComponentLink2URL: https://www.mouser.com.tr/ProductDetail/Vishay-Dale/CRCW040210K0FKED?qs=sGAEpiMZZMu61qfTUdNhG2DpbjADlD3GcalbOv9utCY%3D; Supplier 1: Mouser; Supplier 2: Digi-Key; Supplier Part Number 1: 71-CRCW040210K0FKEDH; Supplier Part Number 2: 541-10.0KYCT-ND
TP51-TP58 TP64-TP71 = PCB - Test Point: Test Point
U17 = IC - TCA9548APWR: Switch ICs - Various 8-Channel I2C Switch; Mouser Part Number: 595-TCA9548APWR; ComponentLink1Description: DataSheet; ComponentLink1URL: http://www.ti.com/general/docs/suppproductinfo.tsp?distId=26&gotoUrl=http%3A%2F%2Fwww.ti.com%2Flit%2Fgpn%2Ftca9548a; ComponentLink2Description: Mouser; ComponentLink2URL: https://www.mouser.com.tr/ProductDetail/Texas-Instruments/TCA9548APWR?qs=iFaFN7AS2WF%252BqSiJMbdYwQ%3D%3D; Minimum Operating Temperature: -40; Maximum Operating Temperature: +85; Supplier 1: Mouser; Supplier 2: Arrow; Supplier 3: Farnell; Supplier 4: Newark; Supplier 5: Digi-Key; Supplier Part Number 1: 595-TCA9548APWR; Supplier Part Number 2: TCA9548APWR; Supplier Part Number 3: 3124884; Supplier Part Number 4: 33AH5006; Supplier Part Number 5: 296-34905-1-ND; Case: TSSOP-24